# EAGLE design GaggiaBoard_V1 (EAGLE 9.6.2)

## Sheet 1 of 2
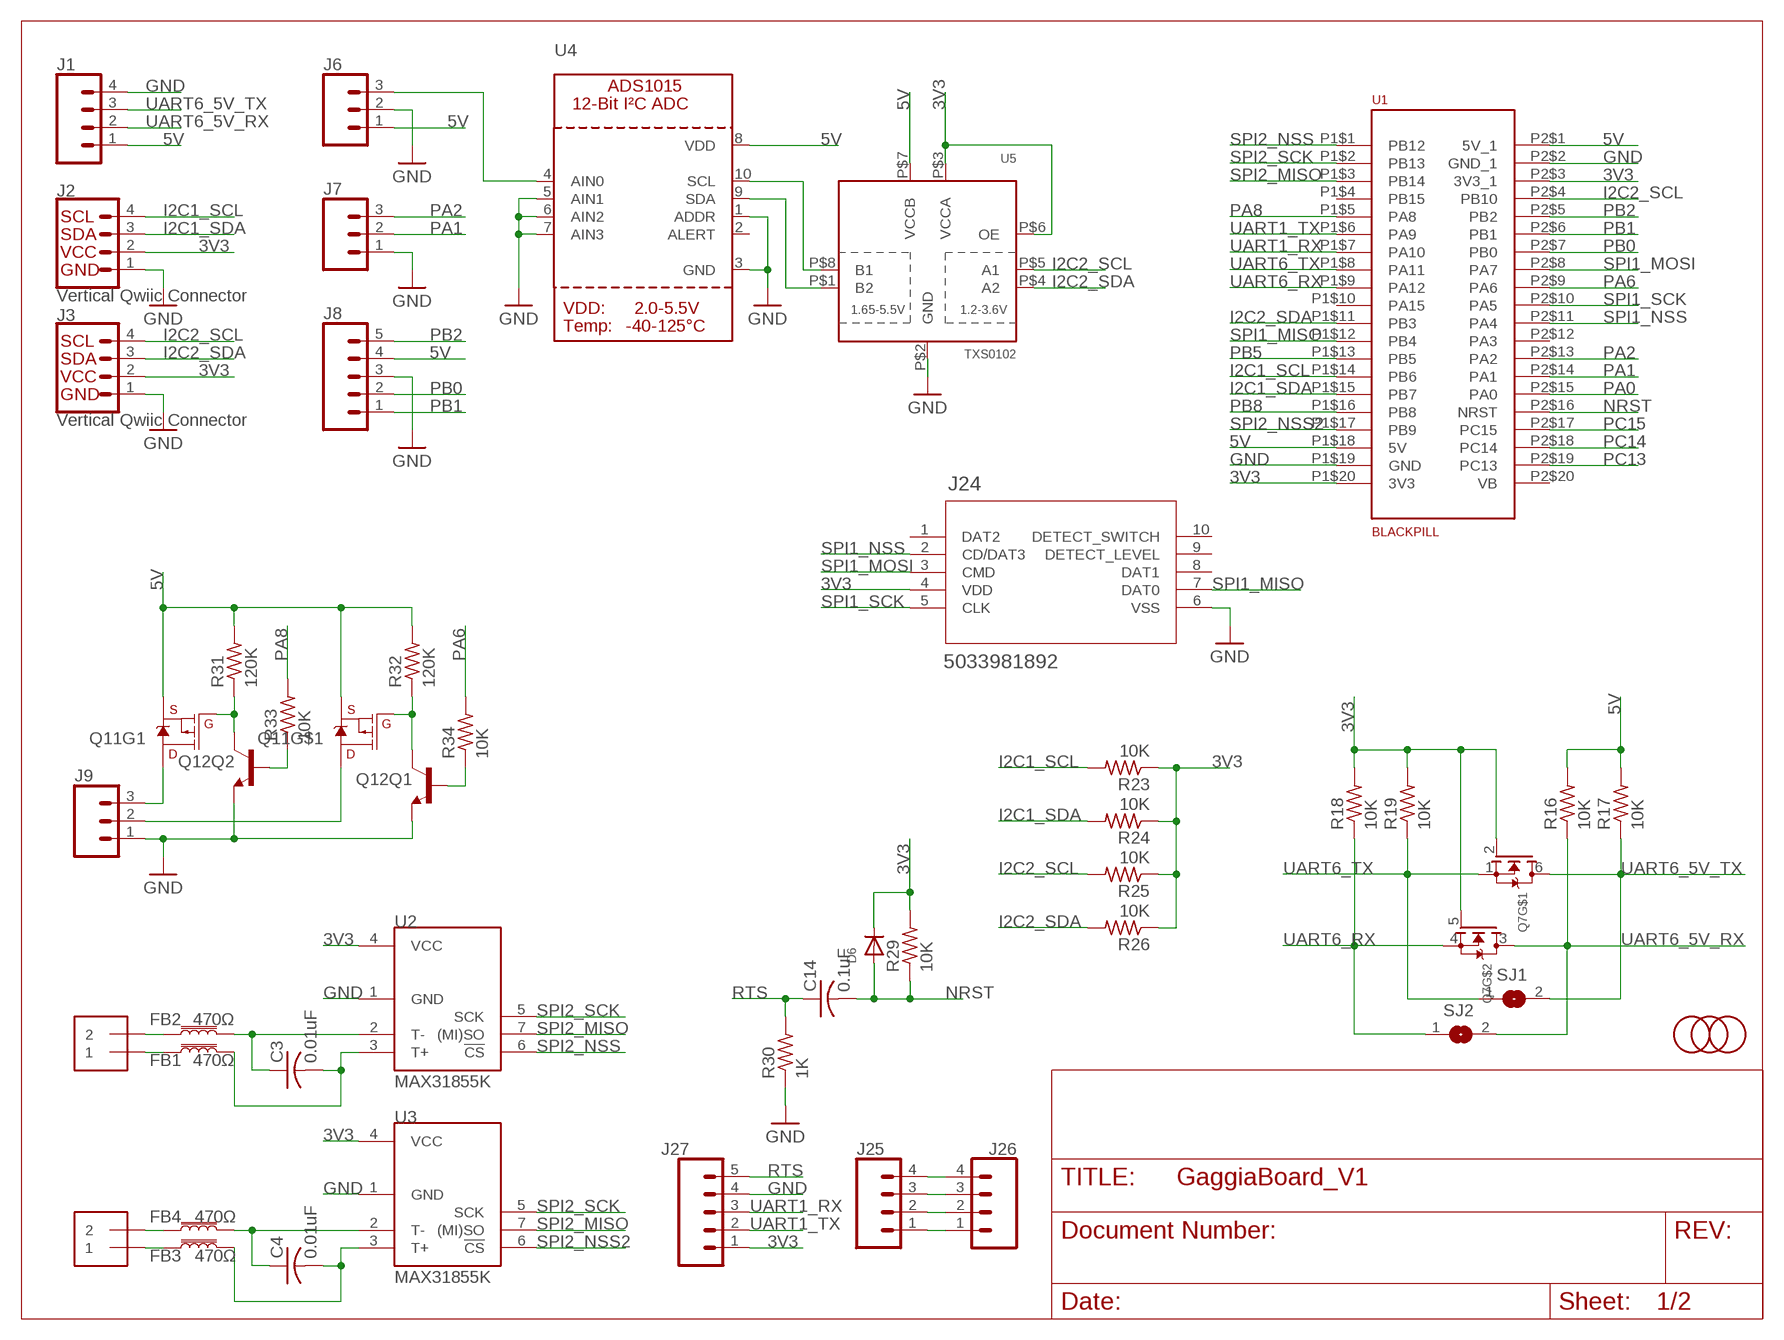
[diagram p0: schematic, sheet 1]

### Parts
C3  0.01uF  C-USC0603  [C0603]
C4  0.01uF  C-USC0603  [C0603]
C14  0.1uF  C-USC0603  [C0603]
D6  DIODESOD-123  [SOD-123]
FB1  470Ω  FERRITE_BEAD-0603-470Ω-100MHZ-1A-200MILIΩ  [0603]
FB2  470Ω  FERRITE_BEAD-0603-470Ω-100MHZ-1A-200MILIΩ  [0603]
FB3  470Ω  FERRITE_BEAD-0603-470Ω-100MHZ-1A-200MILIΩ  [0603]
FB4  470Ω  FERRITE_BEAD-0603-470Ω-100MHZ-1A-200MILIΩ  [0603]
J1  CONN_04POLAR  [MOLEX-1X4]
J2  Vertical Qwiic Connector  QWIIC_CONNECTOR  [JST04_1MM_VERT]
J3  Vertical Qwiic Connector  QWIIC_CONNECTOR  [JST04_1MM_VERT]
J4  1X2-3.5MM  [1X2-3.5MM]
J5  1X2-3.5MM  [1X2-3.5MM]
J6  CONN_03JST-PTH-VERT  [JST-3-PTH-VERT]
J7  CONN_03JST-PTH-VERT  [JST-3-PTH-VERT]
J8  CONN_05JST-VERT  [JST-5-PTH-VERT]
J9  CONN_03JST-PTH-VERT  [JST-3-PTH-VERT]
J24  5033981892  [503398-1892_MOL]
J25  CONN_041X04_NO_SILK  [1X04_NO_SILK]
J26  CONN_041X04_NO_SILK  [1X04_NO_SILK]
J27  CONN_05NO_SILK  [1X05_NO_SILK]
MARK1  FIDUCIAL  [FIDUCIAL_1MM]
MARK2  FIDUCIAL  [FIDUCIAL_1MM]
MARK5  FIDUCIAL  [FIDUCIAL_1MM]
Q7  MOSFET-N_DUAL  [SOT363]
Q11  MOSFET_PCH_DUAL-DMP2240UDM  [SOT26]
Q12  TRANS_NPN_DUAL-MBT3904DW1T1  [SC70-6]
R16  10K  R-US_R0603  [R0603]
R17  10K  R-US_R0603  [R0603]
R18  10K  R-US_R0603  [R0603]
R19  10K  R-US_R0603  [R0603]
R23  10K  R-US_R0603  [R0603]
R24  10K  R-US_R0603  [R0603]
R25  10K  R-US_R0603  [R0603]
R26  10K  R-US_R0603  [R0603]
R29  10K  R-US_R0603  [R0603]
R30  1K  R-US_R0603  [R0603]
R31  120K  R-US_R0603  [R0603]
R32  120K  R-US_R0603  [R0603]
R33  10K  R-US_R0603  [R0603]
R34  10K  R-US_R0603  [R0603]
SJ1  SOLDERJUMPER  [SOLDERJUMPER_ARROW_NOPASTE]
SJ2  SOLDERJUMPER  [SOLDERJUMPER_ARROW_NOPASTE]
U1  BLACKPILL  [BLACKPILL]
U2  MAX31855K  [SO08]
U3  MAX31855K  [SO08]
U4  ADC_ADS1015  [MSOP10]
U5  TXS0102  [VFSOP-8]

### Nets
3V3: D6.C J2.2 J3.2 J24.4(VDD) J25.1 J26.1 J27.1 Q7.2(G) Q7.5(G) R18.2 R19.2 R23.1 R24.1 R25.1 R26.1 R29.2 U1.P1$20(3V3) U1.P2$3(3V3_1) U2.4(VCC) U3.4(VCC) U5.P$3(VCCA) U5.P$6(OE) ; also sheet 2
5V: J1.1 J6.1 J8.4 Q11.S1(S) Q11.S2(S) R16.2 R17.2 R31.2 R32.2 U1.P1$18(5V) U1.P2$1(5V_1) U4.8(VDD) U5.P$7(VCCB) ; also sheet 2
GND: J1.4 J2.1 J3.1 J6.2 J7.1 J8.3 J9.1 J24.6(VSS) J25.4 J26.4 J27.4 Q12.1(Q2:E) Q12.4(Q1:E) R30.1 U1.P1$19(GND) U1.P2$2(GND_1) U2.1(GND) U3.1(GND) U4.1(ADDR) U4.3(GND) U4.5(AIN1) U4.6(AIN2) U4.7(AIN3) U5.P$2(GND) ; also sheet 2
I2C1_SCL: J2.4 R23.2 U1.P1$14(PB6)
I2C1_SDA: J2.3 R24.2 U1.P1$15(PB7)
I2C2_SCL: J3.4 R25.2 U1.P2$4(PB10) U5.P$5(A1)
I2C2_SDA: J3.3 R26.2 U1.P1$11(PB3) U5.P$4(A2)
N$3: FB2.1 J4.2
N$4: FB1.1 J4.1
N$5: C3.1 FB2.2 U2.2(T-)
N$6: FB4.1 J5.2
N$22: U4.10(SCL) U5.P$8(B1)
N$23: FB3.1 J5.1
N$25: C4.1 FB4.2 U3.2(T-)
N$26: C3.2 FB1.2 U2.3(T+)
N$31: C4.2 FB3.2 U3.3(T+)
N$38: U4.9(SDA) U5.P$1(B2)
N$41: J9.2 Q11.D2(D)
N$42: J9.3 Q11.D1(D)
N$46: Q12.2(Q2:B) R33.1
N$47: Q11.G2(G) Q12.3(Q1:C) R32.1
N$48: Q11.G1(G) Q12.6(Q2:C) R31.1
N$49: Q12.5(Q1:B) R34.1
NRST: C14.2 D6.A R29.1 U1.P2$16(NRST)
PA0: U1.P2$15(PA0) ; also sheet 2
PA1: J7.2 U1.P2$14(PA1)
PA2: J7.3 U1.P2$13(PA2)
PA6: R34.2 U1.P2$9(PA6)
PA8: R33.2 U1.P1$5(PA8)
PB0: J8.2 U1.P2$7(PB0)
PB1: J8.1 U1.P2$6(PB1)
PB2: J8.5 U1.P2$5(PB2)
PB5: U1.P1$13(PB5) ; also sheet 2
PB8: U1.P1$16(PB8) ; also sheet 2
PC13: U1.P2$19(PC13) ; also sheet 2
PC14: U1.P2$18(PC14) ; also sheet 2
PC15: U1.P2$17(PC15) ; also sheet 2
PRESSURE: J6.3 U4.4(AIN0)
RTS: C14.1 J27.5 R30.2
SPI1_MISO: J24.7(DAT0) U1.P1$12(PB4)
SPI1_MOSI: J24.3(CMD) U1.P2$8(PA7)
SPI1_NSS: J24.2(CD/DAT3) U1.P2$11(PA4)
SPI1_SCK: J24.5(CLK) U1.P2$10(PA5)
SPI2_MISO: U1.P1$3(PB14) U2.7((MI)SO) U3.7((MI)SO)
SPI2_NSS: U1.P1$1(PB12) U2.6(!CS)
SPI2_NSS2: U1.P1$17(PB9) U3.6(!CS)
SPI2_SCK: U1.P1$2(PB13) U2.5(SCK) U3.5(SCK)
SWCLK: J25.3 J26.3
SWDIO: J25.2 J26.2
UART1_RX: J27.3 U1.P1$7(PA10)
UART1_TX: J27.2 U1.P1$6(PA9)
UART6_5V_RX: J1.2 Q7.3(D) R16.1 SJ2.2
UART6_5V_TX: J1.3 Q7.6(D) R17.1 SJ1.2
UART6_RX: Q7.4(S) R18.1 SJ2.1 U1.P1$9(PA12)
UART6_TX: Q7.1(S) R19.1 SJ1.1 U1.P1$8(PA11)
Unconnected: J24.1(DAT2) J24.8(DAT1) J24.9(DETECT_LEVEL) J24.10(DETECT_SWITCH) U1.P1$4(PB15) U1.P1$10(PA15) U1.P2$12(PA3) U1.P2$20(VB) U4.2(ALERT)

## Sheet 2 of 2
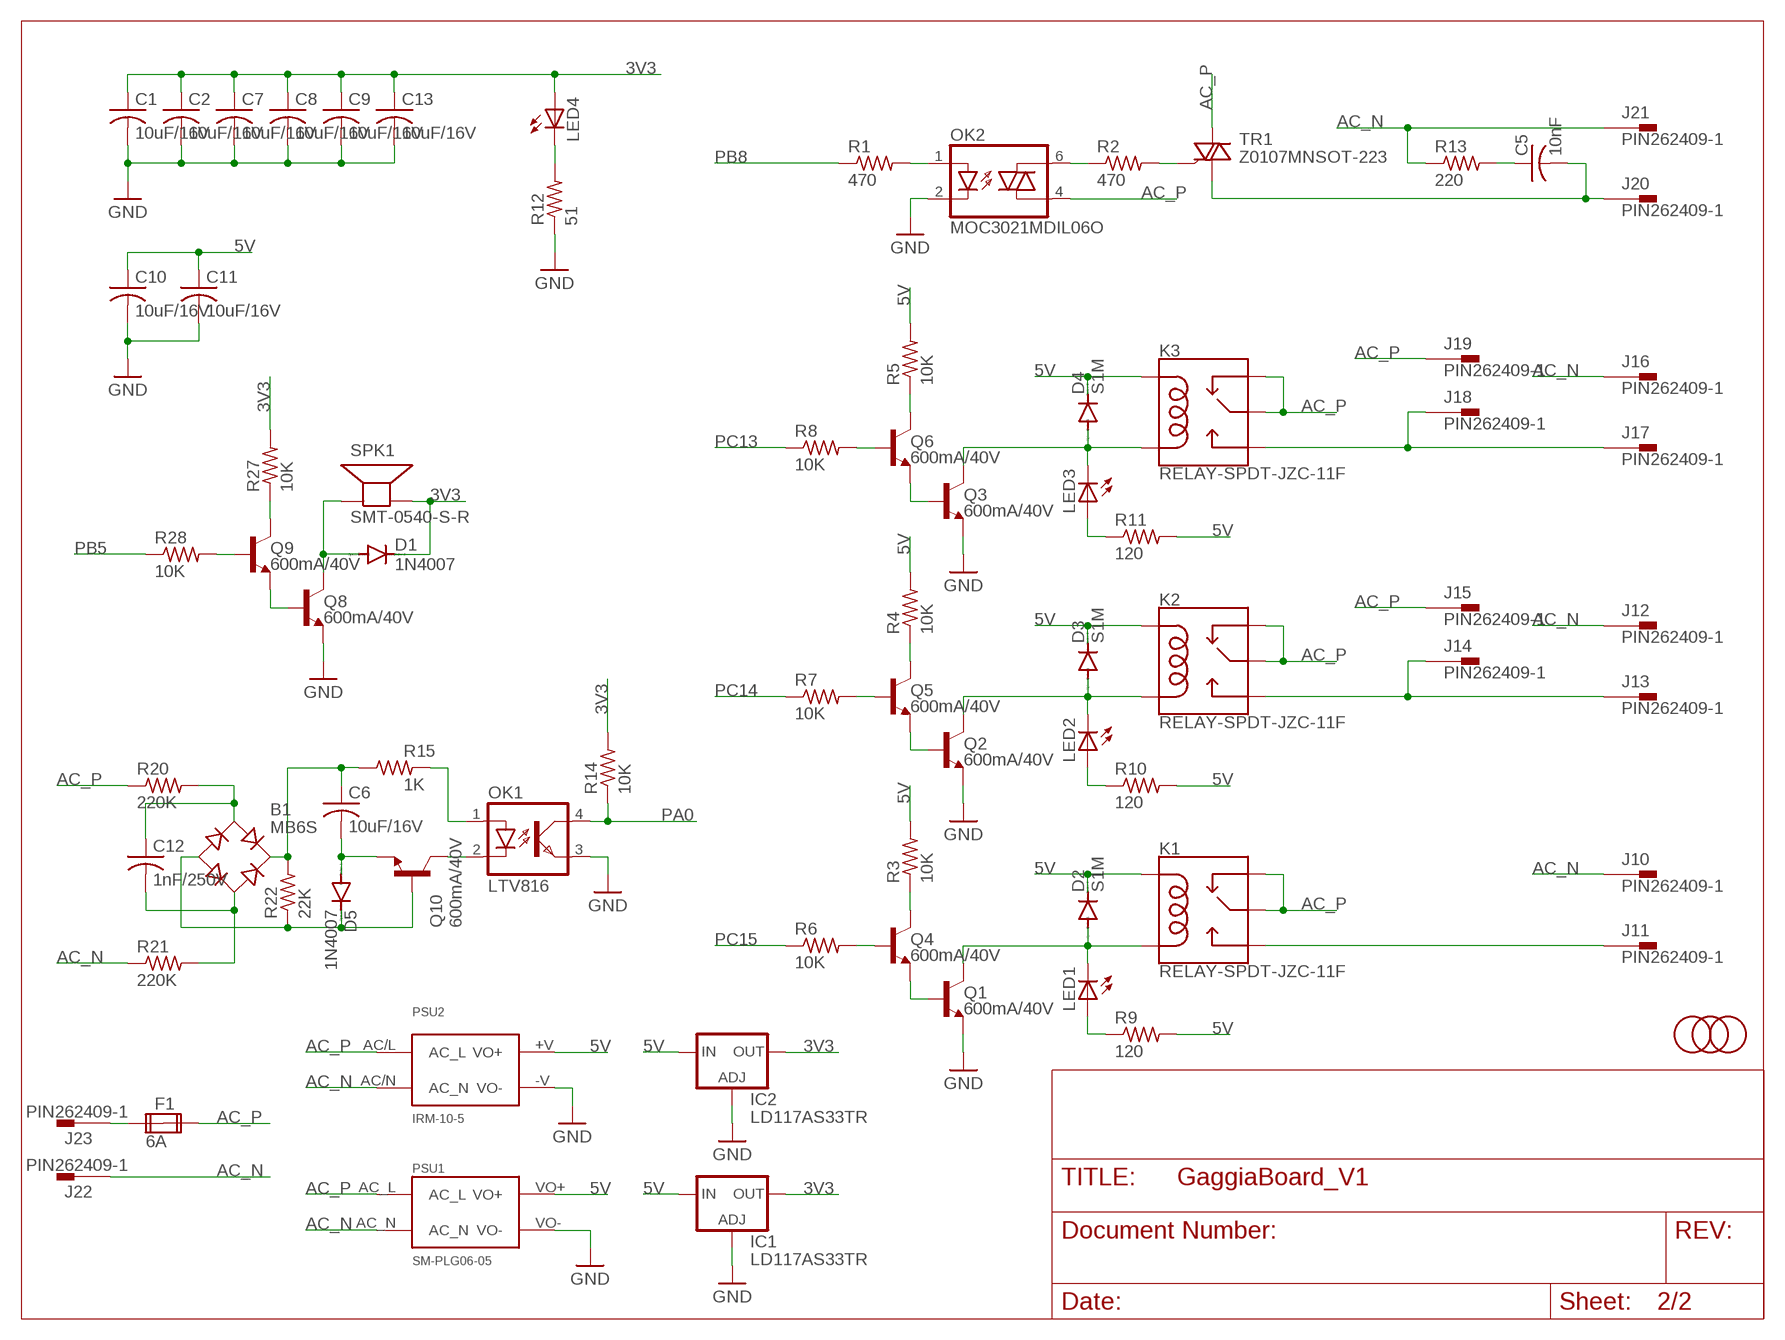
[diagram p1: schematic, sheet 2]

### Parts
B1  MB6S  [SOIC-4]
C1  10uF/16V  C-USC0603  [C0603]
C2  10uF/16V  C-USC0603  [C0603]
C5  10nF  C-USC1206  [C1206]
C6  10uF/16V  C-USC0603  [C0603]
C7  10uF/16V  C-USC0603  [C0603]
C8  10uF/16V  C-USC0603  [C0603]
C9  10uF/16V  C-USC0603  [C0603]
C10  10uF/16V  C-USC0603  [C0603]
C11  10uF/16V  C-USC0603  [C0603]
C12  1nF/250V  C-USC0603  [C0603]
C13  10uF/16V  C-USC0603  [C0603]
D1  1N4007  DIODE-DO214AC  [DO214AC]
D2  S1M  [SMA]
D3  S1M  [SMA]
D4  S1M  [SMA]
D5  1N4007  DIODE-DO214AC  [DO214AC]
F1  6A  FUSE2P  [FUSE1]
IC1  LD117AS33TR  [SOT223]
IC2  LD117AS33TR  [SOT223]
J10  PIN262409-1  [62409-1]
J11  PIN262409-1  [62409-1]
J12  PIN262409-1  [62409-1]
J13  PIN262409-1  [62409-1]
J14  PIN262409-1  [62409-1]
J15  PIN262409-1  [62409-1]
J16  PIN262409-1  [62409-1]
J17  PIN262409-1  [62409-1]
J18  PIN262409-1  [62409-1]
J19  PIN262409-1  [62409-1]
J20  PIN262409-1  [62409-1]
J21  PIN262409-1  [62409-1]
J22  PIN262409-1  [62409-1]
J23  PIN262409-1  [62409-1]
K1  RELAY-SPDT-JZC-11F  [RELAY-JZC]
K2  RELAY-SPDT-JZC-11F  [RELAY-JZC]
K3  RELAY-SPDT-JZC-11F  [RELAY-JZC]
LED1  LEDCHIPLED_1206  [CHIPLED_1206]
LED2  LEDCHIPLED_1206  [CHIPLED_1206]
LED3  LEDCHIPLED_1206  [CHIPLED_1206]
LED4  LEDCHIPLED_1206  [CHIPLED_1206]
MARK3  FIDUCIAL  [FIDUCIAL_1MM]
MARK4  FIDUCIAL  [FIDUCIAL_1MM]
MARK6  FIDUCIAL  [FIDUCIAL_1MM]
OK1  LTV816  [DIL04]
OK2  MOC3021MDIL06O  [DIL06O]
PSU1  SM-PLG06-05  [SM-PLG06]
PSU2  IRM-10-5  [IRM-10]
Q1  600mA/40V  TRANS_NPN-MMBT2222AL  [SOT23-3]
Q2  600mA/40V  TRANS_NPN-MMBT2222AL  [SOT23-3]
Q3  600mA/40V  TRANS_NPN-MMBT2222AL  [SOT23-3]
Q4  600mA/40V  TRANS_NPN-MMBT2222AL  [SOT23-3]
Q5  600mA/40V  TRANS_NPN-MMBT2222AL  [SOT23-3]
Q6  600mA/40V  TRANS_NPN-MMBT2222AL  [SOT23-3]
Q8  600mA/40V  TRANS_NPN-MMBT2222AL  [SOT23-3]
Q9  600mA/40V  TRANS_NPN-MMBT2222AL  [SOT23-3]
Q10  600mA/40V  TRANS_NPN-MMBT2222AL  [SOT23-3]
R1  470  R-US_R0603  [R0603]
R2  470  R-US_R0603  [R0603]
R3  10K  R-US_R0603  [R0603]
R4  10K  R-US_R0603  [R0603]
R5  10K  R-US_R0603  [R0603]
R6  10K  R-US_R0603  [R0603]
R7  10K  R-US_R0603  [R0603]
R8  10K  R-US_R0603  [R0603]
R9  120  R-US_R0603  [R0603]
R10  120  R-US_R0603  [R0603]
R11  120  R-US_R0603  [R0603]
R12  51  R-US_R0603  [R0603]
R13  220  R-US_R2512  [R2512]
R14  10K  R-US_R0603  [R0603]
R15  1K  R-US_R0603  [R0603]
R20  220K  R-US_R1206  [R1206]
R21  220K  R-US_R1206  [R1206]
R22  22K  R-US_R0603  [R0603]
R27  10K  R-US_R0603  [R0603]
R28  10K  R-US_R0603  [R0603]
SPK1  SMT-0540-S-R  [SMT-0540-S-R]
TR1  Z0107MNSOT-223  [SOT223]

### Nets
3V3: C1.1 C2.1 C7.1 C8.1 C9.1 C13.1 D1.C IC1.4(OUT) IC2.4(OUT) LED4.A R14.2 R27.2 SPK1.+(-) ; also sheet 1
3WAY: J11.A1 J11.A2 K1.3(NO)
5V: C10.1 C11.1 D2.C D3.C D4.C IC1.3(IN) IC2.3(IN) K1.5(COIL1) K2.5(COIL1) K3.5(COIL1) PSU1.VO+ PSU2.+V(VO+) R3.2 R4.2 R5.2 R9.2 R10.2 R11.2 ; also sheet 1
AC_N: J10.A1 J10.A2 J12.A1 J12.A2 J16.A1 J16.A2 J21.A1 J21.A2 J22.A1 J22.A2 PSU1.AC_N PSU2.AC/N(AC_N) R13.1 R21.1
AC_P: F1.2A J15.A1 J15.A2 J19.A1 J19.A2 K1.2(NC) K1.4(MAIN) K2.2(NC) K2.4(MAIN) K3.2(NC) K3.4(MAIN) OK2.4(A1) PSU1.AC_L PSU2.AC/L(AC_L) R20.1 TR1.2(A2) TR1.4(A2)
GND: C1.2 C2.2 C7.2 C8.2 C9.2 C10.2 C11.2 C13.2 IC1.1(ADJ) IC2.1(ADJ) OK1.3(EMIT) OK2.2(C) PSU1.VO- PSU2.-V(VO-) Q1.2(E) Q2.2(E) Q3.2(E) Q8.2(E) R12.1 ; also sheet 1
HEATER_1: J13.A1 J13.A2 J14.A1 J14.A2 K2.3(NO)
HEATER_2: J17.A1 J17.A2 J18.A1 J18.A2 K3.3(NO)
N$1: F1.1A J23.A1 J23.A2
N$2: B1.- D5.C Q10.1(B) R22.1
N$7: OK1.2(C) Q10.3(C)
N$8: OK2.6(A2) R2.1
N$9: R2.2 TR1.3(G)
N$10: D2.A K1.1(COIL2) LED1.C Q1.3(C)
N$11: D3.A K2.1(COIL2) LED2.C Q2.3(C)
N$12: D4.A K3.1(COIL2) LED3.C Q3.3(C)
N$13: Q1.1(B) Q4.2(E)
N$14: Q2.1(B) Q5.2(E)
N$15: Q3.1(B) Q6.2(E)
N$16: Q6.1(B) R8.2
N$17: Q6.3(C) R5.1
N$18: Q5.3(C) R4.1
N$19: Q5.1(B) R7.2
N$20: Q4.3(C) R3.1
N$21: Q4.1(B) R6.2
N$24: LED1.A R9.1
N$27: LED4.C R12.2
N$28: LED2.A R10.1
N$29: LED3.A R11.1
N$30: D1.A Q8.3(C) SPK1.-(+)
N$32: C5.1 R13.2
N$33: Q8.1(B) Q9.2(E)
N$34: Q9.1(B) R28.2
N$35: Q9.3(C) R27.1
N$36: B1.~1(AC1) C12.2 R21.2
N$37: B1.~2(AC2) C12.1 R20.2
N$39: OK2.1(A) R1.2
N$43: C6.2 D5.A Q10.2(E)
N$44: OK1.1(A) R15.2
N$45: B1.+ C6.1 R15.1 R22.2
PA0: OK1.4(COL) R14.1 ; also sheet 1
PB5: R28.1 ; also sheet 1
PB8: R1.1 ; also sheet 1
PC13: R8.1 ; also sheet 1
PC14: R7.1 ; also sheet 1
PC15: R6.1 ; also sheet 1
PUMP_P: C5.2 J20.A1 J20.A2 TR1.1(A1)
Unconnected: F1.1B F1.2B

## Library data of the parts
B1 = rectifier:MB*S: Bridge Rectifier Source: http://www.fairchildsemi.com/ds/MB/MB6S.pdf; LCSC: C2487
C1 C2 C6-C11 C13 = rcl:C-US: CAPACITOR, American symbol; LCSC: C86275; SPICEPREFIX: C
C3 C4 = rcl:C-US: CAPACITOR, American symbol; LCSC: C100042; SPICEPREFIX: C
C5 = rcl:C-US: CAPACITOR, American symbol; LCSC: C107192; SPICEPREFIX: C
C12 = rcl:C-US: CAPACITOR, American symbol; LCSC: C277510; SPICEPREFIX: C
C14 = rcl:C-US: CAPACITOR, American symbol; LCSC: C14663; SPICEPREFIX: C
D1 D5 = diode:DIODE-: DIODE; LCSC: C727081
D2-D4 = diode:S1M; LCSC: C155378
D6 = adafruit:DIODE: Diode SMADIODE - SMA Surface Mount Package 20V 1A Schottky Diode Digikey: 641-1014-6-ND DO-1N4148 - Through Hole Small Current Diode SOD-123 20V 1 A (.5mV Vf) Schottky Diode - Digikey: MBRX120TPMSCT-ND SOD-323 10V 570mA (.38mV Vf, 3ns) Schottky Diode - Digikey: ZLLS410CT-ND SOD-523 30V 30mA Schottky Diode (RB751S-40TE61) - Digikey: RB751S-40TE61CT-ND SOT23-R/W - SOT23 Package (R = Solder Paste/Reflow Ovens, W = Hand-Soldering) BAT54Film 40V 300mA - Digikey: 497-7162-1-ND; LCSC: C83528
F1 = special:FUSE2P: FUSE 5 x 20 mm; LCSC: C206887
FB1-FB4 = SparkFun-Coils:FERRITE_BEAD: Ferrite Bead (blocks, cores, rings, chokes, etc.) Inductor with layers of ferrite used to suppress high frequencies. Often used to isolate high frequency noise. SparkFun Products: IOIO-OTG - V2.2 <https://www.sparkfun.com/products/13613> SparkFun SAMD21 Mini Breakout <https://www.sparkfun.com/products/13664> SparkFun 6 Degrees of Freedom Breakout - LSM6DS3 <https://www.sparkfun.com/products/13339> SparkFun SAMD21 Dev Breakout <https://www.sparkfun.com/products/13672>; LCSC: C883591; PROD_ID: NDUC-12579
IC1 IC2 = v-reg:LD117A?*: Low drop fixed and adjustable positive voltage regulators 1 A Source: http://www.st.com/stonline/products/literature/ds/7194/ld1117axx.pdf; LCSC: C152529
J1 = SparkFun-Connectors:CONN_04: Multi connection point. Often used as Generic Header-pin footprint for 0.1 inch spaced/style header connections On any of the 0.1 inch spaced packages, you can populate with these: Break Away Headers - Straight <https://www.sparkfun.com/products/116> (PRT-00116) Break Away Male Headers - Right Angle <https://www.sparkfun.com/products/553> (PRT-00553) Female Headers <https://www.sparkfun.com/products/115> (PRT-00115) Break Away Headers - Machine Pin <https://www.sparkfun.com/products/117> (PRT-00117) Break Away Female Headers - Swiss Machine Pin <https://www.sparkfun.com/products/743> (PRT-00743) For SCREWTERMINALS and SPRING TERMINALS visit here: Screw Terimnals on SparkFun.com <https://www.sparkfun.com/search/results?term=Screw+Terminals> (5mm/3.5mm/2.54mm spacing) This device is also useful as a general connection point to wire up your design to another part of your project. Our various solder wires solder well into these plated through hole pads. Hook-Up Wire - Assortment (Stranded, 22 AWG) <https://www.sparkfun.com/products/11375> (PRT-11375) Hook-Up Wire - Assortment (Solid Core, 22 AWG) <https://www.sparkfun.com/products/11367> (PRT-11367) View the entire wire category on our website here <https://www.sparkfun.com/categories/141> Special notes: Molex polarized connector foot print use with SKU : PRT-08231 with associated crimp pins and housings. 1MM SMD Version SKU: PRT-10208; LCSC: C144395; PROD_ID: CONN-08186; SF_ID: PRT-08231
J2 J3 = SparkFun-Connectors:QWIIC_CONNECTOR: SparkFun I2C Standard Qwiic Connector An SMD 1mm pitch JST connector makes it easy and quick (get it? Qwiic?) to connect I2C devices to each other. The Qwiic system <http://www.sparkfun.com/qwiic> enables fast and solderless connection between popular platforms and various sensors and actuators. We carry 200mm <https://www.sparkfun.com/products/14204>, 100mm <https://www.sparkfun.com/products/14205>, 50mm <https://www.sparkfun.com/products/14206>, and breadboard friendly <https://www.sparkfun.com/products/14207> Qwiic cables. We also offer 10 pcs strips <https://www.sparkfun.com/products/14323> the SMD connectors.; LCSC: C160390; PROD_ID: CONN-14483
J4 J5 = adafruit:1X2: 3.5mm Terminal block http://www.ladyada.net/library/pcb/eaglelibrary.html; LCSC: C474892
J6 J7 J9 = SparkFun-Connectors:CONN_03: Multi connection point. Often used as Generic Header-pin footprint for 0.1 inch spaced/style header connections On any of the 0.1 inch spaced packages, you can populate with these: Break Away Headers - Straight <https://www.sparkfun.com/products/116> (PRT-00116) Break Away Male Headers - Right Angle <https://www.sparkfun.com/products/553> (PRT-00553) Female Headers <https://www.sparkfun.com/products/115> (PRT-00115) Break Away Headers - Machine Pin <https://www.sparkfun.com/products/117> (PRT-00117) Break Away Female Headers - Swiss Machine Pin <https://www.sparkfun.com/products/743> (PRT-00743) Stackable Header - 3 Pin (Female, 0.1") <https://www.sparkfun.com/products/13875> (PRT-13875) For SCREWTERMINALS and SPRING TERMINALS visit here: Screw Terimnals on SparkFun.com <https://www.sparkfun.com/search/results?term=Screw+Terminals> (5mm/3.5mm/2.54mm spacing) This device is also useful as a general connection point to wire up your design to another part of your project. Our various solder wires solder well into these plated through hole pads. Hook-Up Wire - Assortment (Stranded, 22 AWG) <https://www.sparkfun.com/products/11375> (PRT-11375) Hook-Up Wire - Assortment (Solid Core, 22 AWG) <https://www.sparkfun.com/products/11367> (PRT-11367) View the entire wire category on our website here <https://www.sparkfun.com/categories/141> Special notes: Molex polarized connector foot print use with SKU : PRT-08232 with associated crimp pins and housings.; LCSC: C131339; PROD_ID: CONN-13230
J8 = SparkFun-Connectors:CONN_05: Multi connection point. Often used as Generic Header-pin footprint for 0.1 inch spaced/style header connections On any of the 0.1 inch spaced packages, you can populate with these: Break Away Headers - Straight <https://www.sparkfun.com/products/116> (PRT-00116) Break Away Male Headers - Right Angle <https://www.sparkfun.com/products/553> (PRT-00553) Female Headers <https://www.sparkfun.com/products/115> (PRT-00115) Break Away Headers - Machine Pin <https://www.sparkfun.com/products/117> (PRT-00117) Break Away Female Headers - Swiss Machine Pin <https://www.sparkfun.com/products/743> (PRT-00743) For SCREWTERMINALS and SPRING TERMINALS visit here: Screw Terimnals on SparkFun.com <https://www.sparkfun.com/search/results?term=Screw+Terminals> (5mm/3.5mm/2.54mm spacing) This device is also useful as a general connection point to wire up your design to another part of your project. Our various solder wires solder well into these plated through hole pads. Hook-Up Wire - Assortment (Stranded, 22 AWG) <https://www.sparkfun.com/products/11375> (PRT-11375) Hook-Up Wire - Assortment (Solid Core, 22 AWG) <https://www.sparkfun.com/products/11367> (PRT-11367) View the entire wire category on our website here <https://www.sparkfun.com/categories/141> Special notes: Molex polarized connector foot print use with SKU : PRT-08231 with associated crimp pins and housings. 1MM SMD Version SKU: PRT-10208; LCSC: C157993
J10-J23 = con-faston:PIN2: Flachstecker Typ Tyco/Electronics/AMP TAB, FASTON Printed Circuit Board Tabs Source: http://www.buerklin.com, http://catalog.tycoelectronics.com; LCSC: C86495; OC_FARNELL: unknown; OC_NEWARK: unknown
J24 = discrete:5033981892: MOLEX 503398-1892 MEMORY CARD SOCKET; COPYRIGHT: Copyright (C) 2022 Ultra Librarian. All rights reserved.; LCSC: C428492; MANUFACTURER_PART_NUMBER: 5033981892; MFR_NAME: Molex Connector Corporation
J25 J26 = SparkFun-Connectors:CONN_04: Multi connection point. Often used as Generic Header-pin footprint for 0.1 inch spaced/style header connections On any of the 0.1 inch spaced packages, you can populate with these: Break Away Headers - Straight <https://www.sparkfun.com/products/116> (PRT-00116) Break Away Male Headers - Right Angle <https://www.sparkfun.com/products/553> (PRT-00553) Female Headers <https://www.sparkfun.com/products/115> (PRT-00115) Break Away Headers - Machine Pin <https://www.sparkfun.com/products/117> (PRT-00117) Break Away Female Headers - Swiss Machine Pin <https://www.sparkfun.com/products/743> (PRT-00743) For SCREWTERMINALS and SPRING TERMINALS visit here: Screw Terimnals on SparkFun.com <https://www.sparkfun.com/search/results?term=Screw+Terminals> (5mm/3.5mm/2.54mm spacing) This device is also useful as a general connection point to wire up your design to another part of your project. Our various solder wires solder well into these plated through hole pads. Hook-Up Wire - Assortment (Stranded, 22 AWG) <https://www.sparkfun.com/products/11375> (PRT-11375) Hook-Up Wire - Assortment (Solid Core, 22 AWG) <https://www.sparkfun.com/products/11367> (PRT-11367) View the entire wire category on our website here <https://www.sparkfun.com/categories/141> Special notes: Molex polarized connector foot print use with SKU : PRT-08231 with associated crimp pins and housings. 1MM SMD Version SKU: PRT-10208; PROD_ID: CONN-09696
J27 = SparkFun-Connectors:CONN_05: Multi connection point. Often used as Generic Header-pin footprint for 0.1 inch spaced/style header connections On any of the 0.1 inch spaced packages, you can populate with these: Break Away Headers - Straight <https://www.sparkfun.com/products/116> (PRT-00116) Break Away Male Headers - Right Angle <https://www.sparkfun.com/products/553> (PRT-00553) Female Headers <https://www.sparkfun.com/products/115> (PRT-00115) Break Away Headers - Machine Pin <https://www.sparkfun.com/products/117> (PRT-00117) Break Away Female Headers - Swiss Machine Pin <https://www.sparkfun.com/products/743> (PRT-00743) For SCREWTERMINALS and SPRING TERMINALS visit here: Screw Terimnals on SparkFun.com <https://www.sparkfun.com/search/results?term=Screw+Terminals> (5mm/3.5mm/2.54mm spacing) This device is also useful as a general connection point to wire up your design to another part of your project. Our various solder wires solder well into these plated through hole pads. Hook-Up Wire - Assortment (Stranded, 22 AWG) <https://www.sparkfun.com/products/11375> (PRT-11375) Hook-Up Wire - Assortment (Solid Core, 22 AWG) <https://www.sparkfun.com/products/11367> (PRT-11367) View the entire wire category on our website here <https://www.sparkfun.com/categories/141> Special notes: Molex polarized connector foot print use with SKU : PRT-08231 with associated crimp pins and housings. 1MM SMD Version SKU: PRT-10208
K1-K3 = SparkFun-Electromechanical:RELAY-SPDT: SPDT Electromechanical Relay Single-pole, double-throw sealed relays. When current is applied to the coil, it throws a simple changeover switch, terminating the connection from the NC contact to ground and closing the NO contact. Use them to switch high voltage/high current devices. SparkFun Products JQX-15F: Relay SPDT Sealed - 20A <https://www.sparkfun.com/products/10924> (COM-10924) JZC-11F: Relay SPDT Sealed <https://www.sparkfun.com/products/100> (COM-00100); LCSC: C74541; PROD_ID: COMP-09533; SF_SKU: COM-00100
LED1-LED4 = adafruit:LED: LED OSRAM: - CHIPLED LG R971, LG N971, LY N971, LG Q971, LY Q971, LO R971, LY R971 LH N974, LH R974 LS Q976, LO Q976, LY Q976 LO Q996 - Hyper CHIPLED LW Q18S LB Q993, LB Q99A, LB R99A - SideLED LS A670, LO A670, LY A670, LG A670, LP A670 LB A673, LV A673, LT A673, LW A673 LH A674 LY A675 LS A676, LA A676, LO A676, LY A676, LW A676 LS A679, LY A679, LG A679 - Hyper Micro SIDELED® LS Y876, LA Y876, LO Y876, LY Y876 LT Y87S - SmartLED LW L88C, LW L88S LB L89C, LB L89S, LG L890 LS L89K, LO L89K, LY L89K LS L896, LA L896, LO L896, LY L896 - TOPLED LS T670, LO T670, LY T670, LG T670, LP T670 LSG T670, LSP T670, LSY T670, LOP T670, LYG T670 LG T671, LOG T671, LSG T671 LB T673, LV T673, LT T673, LW T673 LH T674 LS T676, LA T676, LO T676, LY T676, LB T676, LH T676, LSB T676, LW T676 LB T67C, LV T67C, LT T67C, LS T67K, LO T67K, LY T67K, LW E67C LS E67B, LA E67B, LO E67B, LY E67B, LB E67C, LV E67C, LT E67C LW T67C LS T679, LY T679, LG T679 LS T770, LO T770, LY T770, LG T770, LP T770 LB T773, LV T773, LT T773, LW T773 LH T774 LS E675, LA E675, LY E675, LS T675 LS T776, LA T776, LO T776, LY T776, LB T776 LHGB T686 LT T68C, LB T68C - Hyper Mini TOPLED® LB M676 - Mini TOPLED Santana® LG M470 LS M47K, LO M47K, LY M47K Source: http://www.osram.convergy.de/; LCSC: C375534
MARK1-MARK6 = adafruit:FIDUCIAL: For use by pick and place machines to calibrate the vision/machine, 1mm By microbuilder.eu
OK1 = optocoupler:LTV816: OPTO COUPLER Source: LITEON, LTV816.pdf; LCSC: C2944043; OC_FARNELL: unknown; OC_NEWARK: unknown
OK2 = discrete:MOC3021M: RANDOM-PHASE OPTOISOLATORS TRIAC DRIVER OUTPUT; LCSC: C5242
PSU1 = discrete:SM-PLG06-05: AC-DC 5V Isolated Switching Power Supply Module
PSU2 = discrete:IRM-10-5: MEAN WELL IRM-10-5 5V 10W Output Switching Power Supply
Q1-Q6 Q8-Q10 = SparkFun-DiscreteSemi:TRANS_NPN: NPN transistor Current controlled devices typically used to amplify current or used as a switch. BC547 - COM-08928 <http://www.sparkfun.com/products/8928> (TO-92 45V 100mA) (1.Collector 2.Base 3.Emitter) 2N3904 - COM-00521 <http://www.sparkfun.com/products/521> (TO-92 40V 200mA) (1.Emitter 2.Base 3.Collector) P2N2222A - COM-12852 <http://www.sparkfun.com/products/12852> (TO-92 40V 600mA) (1.Collector 2.Base 3.Emitter); LCSC: C82460; PROD_ID: TRANS-08049
Q7 = microbuilder:MOSFET-N_DUAL: Dual N-Channel MOSFET SOT363 (2.0x1.25mm) 2N7002PS - 60V, 320mA [Digikey: 568-5984-1-ND]; LCSC: C150488
Q11 = SparkFun-DiscreteSemi:MOSFET_PCH_DUAL: Dual P-Channel -20VDS MOSFET Link to datasheet <http://www.diodes.com/_files/datasheets/ds31197.pdf> SparkFun Products: SparkFun FreeSoC2 Development Board <https://www.sparkfun.com/products/13229>; LCSC: C397948; PROD_ID: TRANS-12444; VALUE: 2A/20V/150mΩ
Q12 = SparkFun-DiscreteSemi:TRANS_NPN_DUAL: Dual NPN Transistors in Single Package The MBT3904W1 puts two general purpose 3904 NPN transistors in a single package. Datasheet <http://www.onsemi.com/pub_link/Collateral/MBT3904DW1T1-D.PDF> SparkFun Products: SparkFun ESP32 Thing <https://www.sparkfun.com/products/13907>; LCSC: C896759; PROD_ID: TRANS-13337
R1 R2 = rcl:R-US_: RESISTOR, American symbol; LCSC: C114669; SPICEPREFIX: R
R3-R8 R14 R16-R19 R23-R29 R33 R34 = rcl:R-US_: RESISTOR, American symbol; LCSC: C98220; SPICEPREFIX: R
R9-R11 = rcl:R-US_: RESISTOR, American symbol; LCSC: C114640; SPICEPREFIX: R
R12 = rcl:R-US_: RESISTOR, American symbol; LCSC: C114628; SPICEPREFIX: R
R13 = rcl:R-US_: RESISTOR, American symbol; LCSC: C877859; SPICEPREFIX: R
R15 R30 = rcl:R-US_: RESISTOR, American symbol; LCSC: C22548; SPICEPREFIX: R
R20 R21 = rcl:R-US_: RESISTOR, American symbol; LCSC: C130275; SPICEPREFIX: R
R22 = rcl:R-US_: RESISTOR, American symbol; LCSC: C114065; SPICEPREFIX: R
R31 R32 = rcl:R-US_: RESISTOR, American symbol; LCSC: C114607; SPICEPREFIX: R
SJ1 SJ2 = microbuilder:SOLDERJUMPER: SMD Solder JUMPER Solder the two pads together to create a connection, or remove the solder to break it. REFLOW - Use this footprint for solder paste and reflow ovens. WAVE - Use this footprint for hand-soldering (larger pads). CLOSED - Has a trace between the two pads to ensure it is closed by default. The trace needs to be cut to disable the jumper, and can be closed again by creating a solder bridge between the two pads.; BOM: EXCLUDE
SPK1 = adafruit:SMT-0540-S-R: SMT-0549-S-R Small surface-mount magnetic buzzer; LCSC: C391029
TR1 = discrete:Z0107MN: Triacs 1.0 Amp 600 Volt; LCSC: C71218
U1 = discrete:BLACKPILL: STM32 BlackPill
U2 U3 = SparkFun-IC-Conversion:MAX31855K: Cold-Junction-Compensated K-Thermocoupleto-Digital Converter (-270°C to +1800°C) The MAX31855K performs cold-junction compensation and digitizes the signal from a type-K thermocouple. The data is output in a 14-bit resolution, SPI™-compatible, read-only format. This converter resolves temperatures to 0.25°C, allows readings as high as +1800°C and as low as -270°C, and exhibits thermocouple accuracy of ±2°C for temperatures ranging from -200°C to +700°C for K-type thermocouples. Datasheet <https://cdn.sparkfun.com/datasheets/Sensors/Temp/MAX31855K.pdf> SparkFun Products SparkFun Thermocouple Breakout - MAX31855K <https://www.sparkfun.com/products/13266> (SEN-13266); LCSC: C52028; PROD_ID: IC-12578
U4 = microbuilder:ADC_ADS1015: ADS1015 - 12-bit 4-Channel I2C ADC with Internal PGA VDD: 2.0-5.5V Sampling Rate: 3.3ksps Gain Settings: 2/3, 1, 2, 4, 8, 16 I2C Address: ADDR low = 1001000x, ADDR high = 1001001x Internal Comparator The ADS1015 includes an internal comparator that can be set to output a high-level on ALERT when the conversion results exceeeds a pre-defined upper level, and will deassert itself when the level falls below a pre-defined lower threshold level. It can also be set to windowed mode where the ALERT pin will be asserted if the data exceeds the upper threshold or falls below the lower threshold.; LCSC: C193969
U5 = adafruit:TXS0102: 2-Bit Bi-Directional Level Shifter (I2C, etc.) Designed for I2C devices and has internal pullups. Not to be confused with TXB010x series. 1.2V-3.6V (VCCA) to 1.65V-5.5V (VCCB) bi-directional level shifter with auto direction sensing. Max data rate - 24Mbps (Push Pull), 2Mbps (Open Drain) Digikey: 296-21931-1-ND; LCSC: C53434

## Board
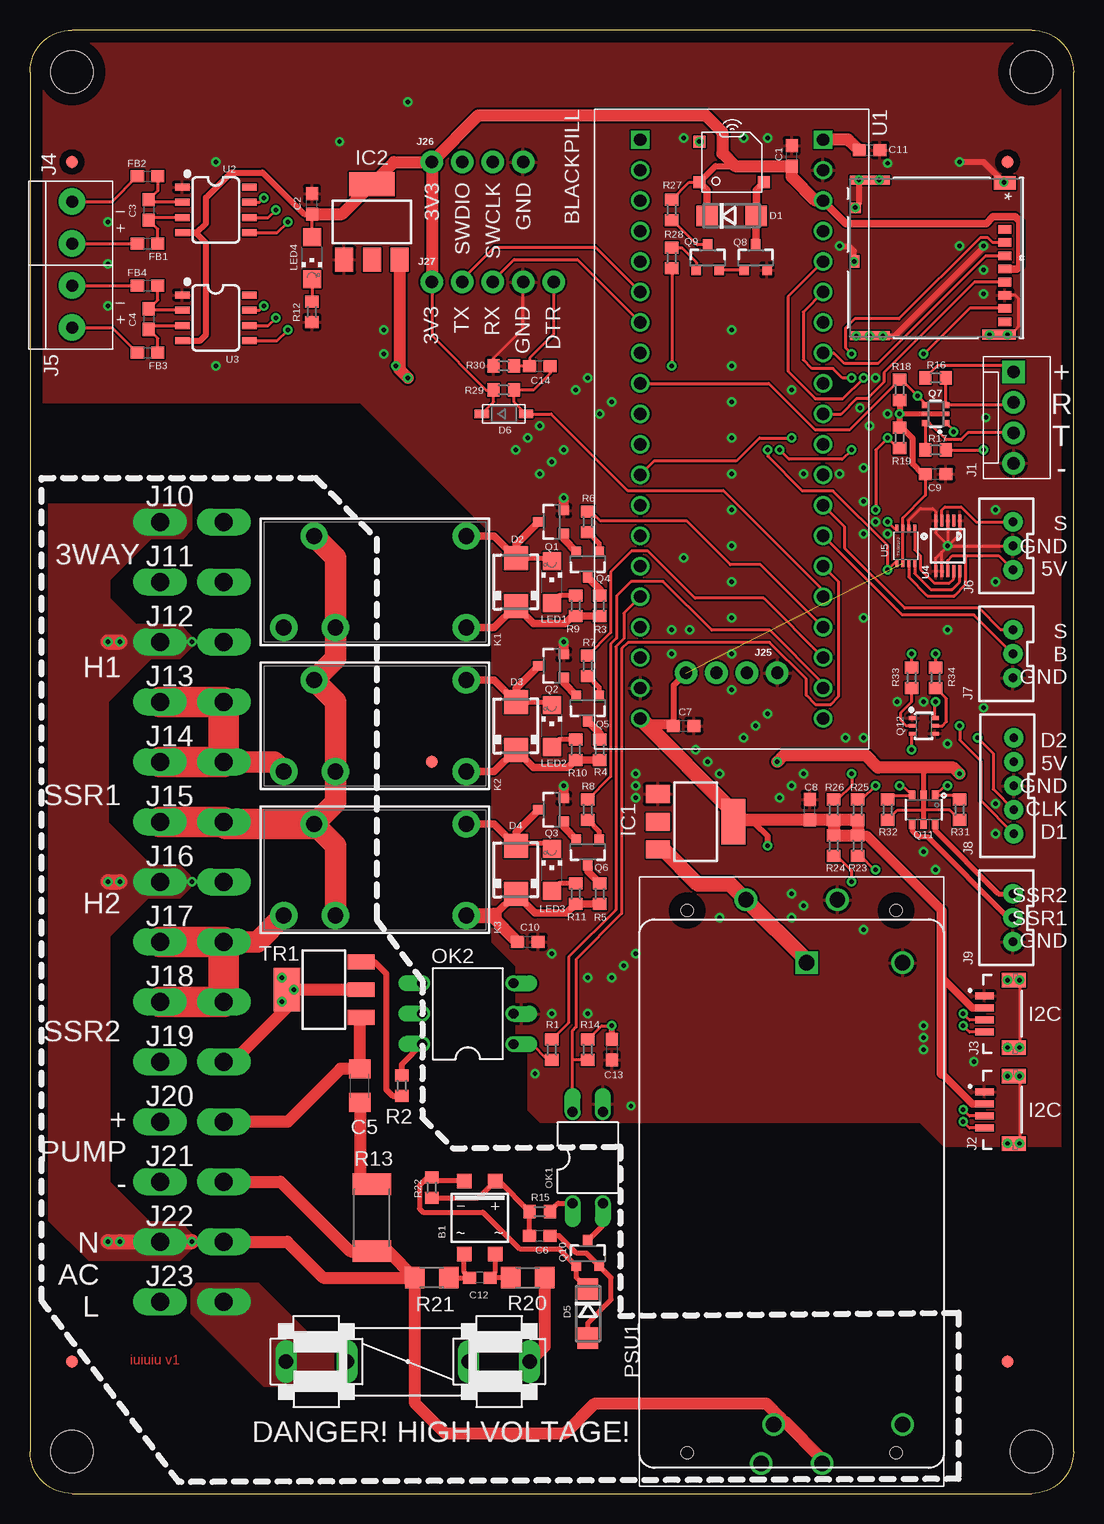
[diagram p2: board, top side]
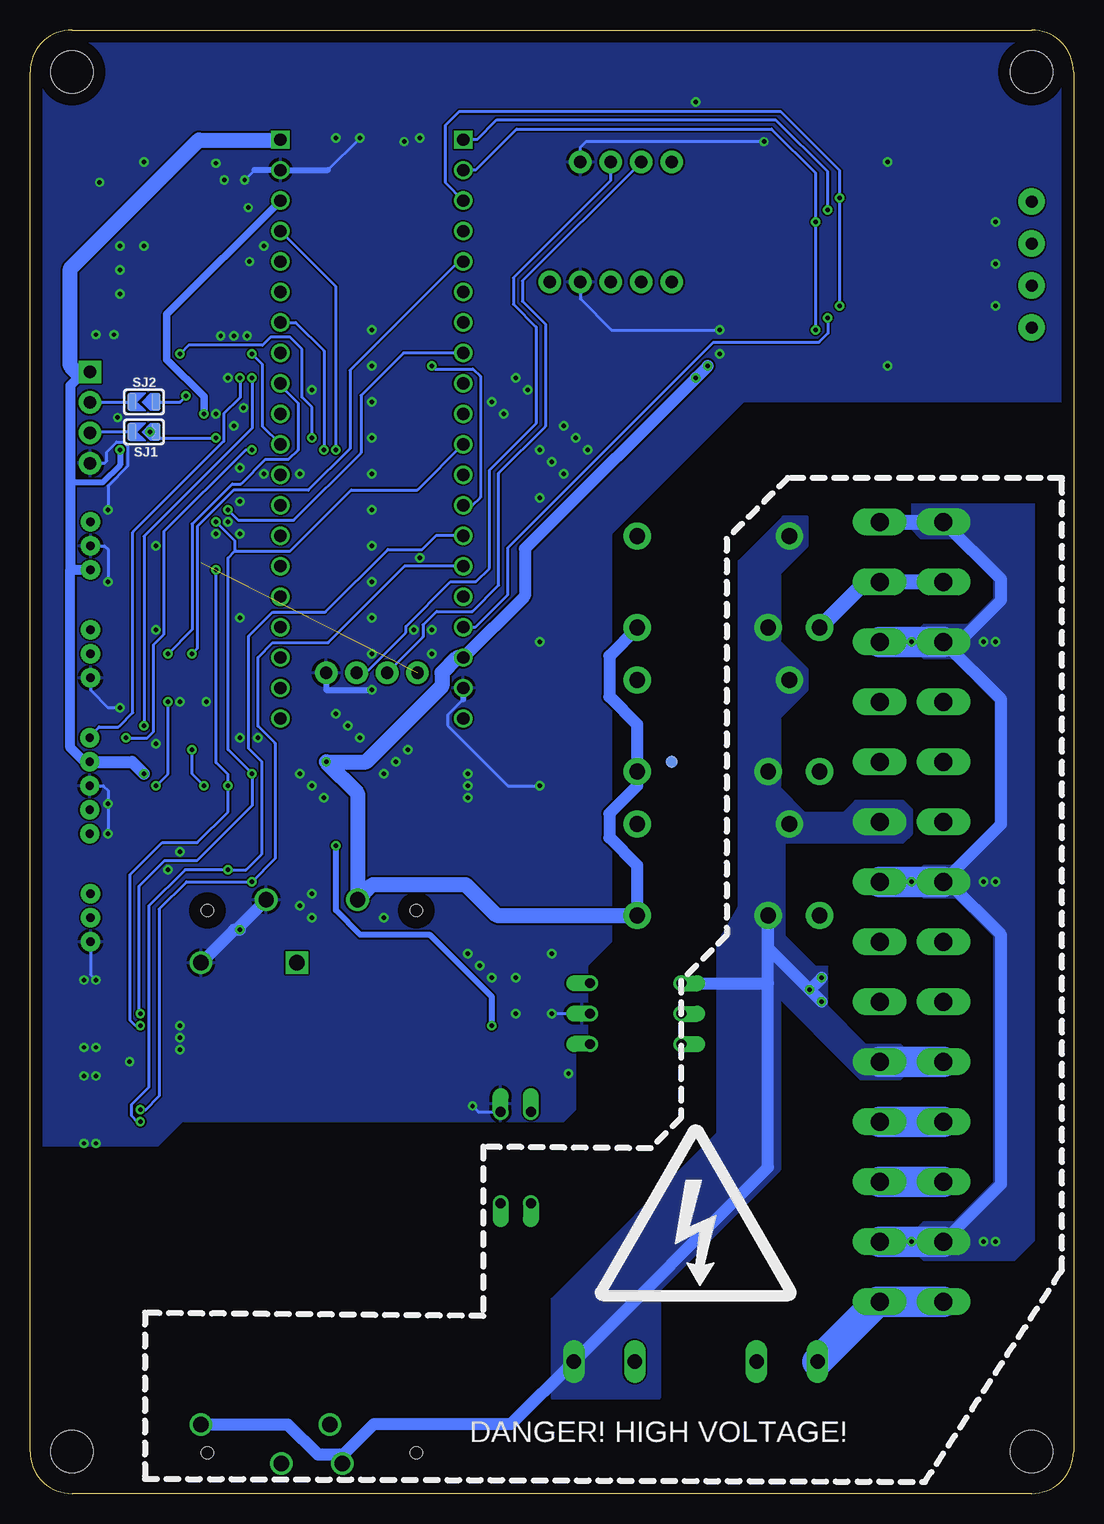
[diagram p3: board, bottom side, seen from below]

Size 87 x 122 mm. Coordinates in mm from the lower left corner, seen from the top.
Outline: 3.5,0 83.5,0 arc90 87,3.5 87,118.5 arc90 83.5,122 3.5,122 arc90 0,118.5 0,3.5 arc90 3.5,0
Copper layers (1*16): Top 0.035mm / dielectric 1.5mm / Bottom 0.035mm
Design rules "default": minimum track width 6mil, minimum drill 0.35mm, track to track 6mil, track to pad 6mil, pad to pad 6mil, via to via 6mil, smd to smd 6mil, copper to edge 40mil, drill to drill 6mil, minimum pad ring 10mil, minimum via ring 8mil, stop-mask expansion 4mil, vias tented up to drill 0mil, thermal gap 10mil
Holes 3.5 mm at 3.5,3.5 83.5,3.5 3.5,118.5 83.5,118.5

### Footprints (pad centres in the part's own frame; a part is rotated, then mirrored left to right if it is on the bottom)
SOIC-4 = smd 1.2 x 1.2: + 1.3,3.05; - -1.3,3.05; ~1 -1.3,-3.05; ~2 1.3,-3.05
C0603 = smd 1.1 x 1: 1 -0.85,0; 2 0.85,0
C1206 = smd 1.6 x 1.8: 1 -1.4,0; 2 1.4,0
DO214AC = smd 1.8 x 1.7: A 2.05,0; C -2.05,0
SMA = smd 2 x 2: A 2,0; C -2,0
SOD-123 = smd 1.2 x 0.7: A 1.85,0; C -1.85,0
FUSE1 = drill 1.194 long: 1A -10.16,0; 1B -5.08,0; 2A 10.16,0; 2B 5.08,0
0603 = smd 1.1 x 1: 1 -0.85,0; 2 0.85,0
SOT223 = smd 1.5 x 2: 1 -2.3,-3.15; 2 0,-3.15; 3 2.3,-3.15 | smd 3.8 x 2: 4 0,3.15
MOLEX-1X4 = drill 1.016 pad 1.88 square: 1 0,0 | drill 1.016 pad 1.88: 2 2.54,0; 3 5.08,0; 4 7.62,0
JST04_1MM_VERT = smd 0.6 x 1.55: 1 -1.478,0.775; 2 -0.478,0.775; 3 0.522,0.775; 4 1.522,0.775 | smd 1.2 x 2: NC1 -2.778,3.2; NC2 2.822,3.2
1X2-3.5MM = drill 1 pad 2.184: 1 1.8,0; 2 -1.7,0
JST-3-PTH-VERT = drill 0.7 pad 1.6: 1 -2,-0.55; 2 0,-0.55; 3 2,-0.55
JST-5-PTH-VERT = drill 0.7 pad 1.6: 1 -4,0.18; 2 -2,0.18; 3 0,0.18; 4 2,0.18; 5 4,0.18
62409-1 = drill 1.5 pad 1.9 long: A1 -2.65,0; A2 2.65,0
503398-1892_MOL = smd 0.711 x 1.092: 1 -2.38,5.776; 2 -1.28,5.776; 3 -0.18,5.776; 4 0.92,5.776; 5 2.02,5.776; 6 3.12,5.776; 7 4.22,5.776; 8 5.32,5.776 | smd 0.889 x 0.94: 9 -4.17,-6.689 | smd 1.041 x 0.787: 10 0.31,-6.764 | smd 1.143 x 1.829: 11 -6.26,5.761 | smd 0.864 x 2.794: 12 6.4,5.276 | smd 0.711 x 3.327: 13 -6.48,-5.489; 14 6.48,-5.489
1X04_NO_SILK = drill 1.016 pad 1.88: 1 0,0; 2 2.54,0; 3 5.08,0; 4 7.62,0
1X05_NO_SILK = drill 1.016 pad 1.88: 1 0,0; 2 2.54,0; 3 5.08,0; 4 7.62,0; 5 10.16,0
RELAY-JZC = drill 1.3 pad 2.286: 1 3.81,-8.89; 2 -3.81,2.032; 3 -3.81,6.35; 4 3.81,3.81; 5 -3.81,-8.89
CHIPLED_1206 = smd 1.5 x 1.5: A 0,-1.75; C 0,1.75
FIDUCIAL_1MM = smd 1 x 1: 1 0,0
DIL04 = drill 0.813 offset: 1 -1.27,-3.81; 2 1.27,-3.81; 3 1.27,3.81; 4 -1.27,3.81
DIL06O = drill 0.813 offset: 1 -2.54,-3.81; 2 0,-3.81; 3 2.54,-3.81; 4 2.54,3.81; 5 0,3.81; 6 -2.54,3.81
SM-PLG06 = drill 1.27: AC_L -23.5,2.54; AC_N -23.5,-2.54; VO+ 23.5,3.81; VO- 23.5,-3.81 | hole 1: -22.6,8.7; -22.6,-8.7; 22.6,8.7; 22.6,-8.7
IRM-10 = drill 1.27 square: +V 19.25,-1.25 | drill 1.27: -V 19.25,-9.25; AC/L -19.25,-9.25; AC/N -19.25,1.5
SOT23-3 = smd 0.8 x 0.9: 1 -0.95,-1; 2 0.95,-1; 3 0,1.1
SOT363 = smd 0.5 x 0.5: 1 -0.75,-0.9; 3 0.75,-0.9; 4 0.75,0.9; 6 -0.75,0.9 | smd 0.4 x 0.5: 2 0,-0.9; 5 0,0.9
SOT26 = smd 0.55 x 0.8: D1 -0.95,1.2; D2 0.95,1.2; G1 -0.95,-1.2; G2 0.95,-1.2; S1 0,1.2; S2 0,-1.2
SC70-6 = smd 0.3 x 0.66: 1 -0.65,-0.92; 2 0,-0.92; 3 0.65,-0.92; 4 0.65,0.92; 5 0,0.92; 6 -0.65,0.92
R0603 = smd 1 x 1.1: 1 -0.85,0; 2 0.85,0
R2512 = smd 1.8 x 3.2: 1 -2.8,0; 2 2.8,0
R1206 = smd 1.6 x 1.803: 1 -1.422,0; 2 1.422,0
SOLDERJUMPER_ARROW_NOPASTE = smd 0.762 x 1.524: 1 -1.016,0; 2 1.016,0
SMT-0540-S-R = smd 1 x 1: + 1.7,-2.7; - 1.7,2.7; M -1.7,-2.7
SOT223' = smd 1.219 x 2.235: 1 -2.311,-3.099; 2 0,-3.099; 3 2.311,-3.099 | smd 3.6 x 2.2: 4 0,3.099
BLACKPILL = drill 1.016 square: P1$1 -22.86,-7.62; P2$1 -22.86,7.62 | drill 1.016: P1$2 -20.32,-7.62; P1$3 -17.78,-7.62; P1$4 -15.24,-7.62; P1$5 -12.7,-7.62; P1$6 -10.16,-7.62; P1$7 -7.62,-7.62; P1$8 -5.08,-7.62; P1$9 -2.54,-7.62; P1$10 0,-7.62; P1$11 2.54,-7.62; P1$12 5.08,-7.62; P1$13 7.62,-7.62; P1$14 10.16,-7.62; P1$15 12.7,-7.62; P1$16 15.24,-7.62; P1$17 17.78,-7.62; P1$18 20.32,-7.62; P1$19 22.86,-7.62; P1$20 25.4,-7.62; P2$2 -20.32,7.62; P2$3 -17.78,7.62; P2$4 -15.24,7.62; P2$5 -12.7,7.62; P2$6 -10.16,7.62; P2$7 -7.62,7.62; P2$8 -5.08,7.62; P2$9 -2.54,7.62; P2$10 0,7.62; P2$11 2.54,7.62; P2$12 5.08,7.62; P2$13 7.62,7.62; P2$14 10.16,7.62; P2$15 12.7,7.62; P2$16 15.24,7.62; P2$17 17.78,7.62; P2$18 20.32,7.62; P2$19 22.86,7.62; P2$20 25.4,7.62
SO08 = smd 0.6 x 1.2: 1 -1.905,-2.8; 2 -0.635,-2.8; 3 0.635,-2.8; 4 1.905,-2.8; 5 1.905,2.8; 6 0.635,2.8; 7 -0.635,2.8; 8 -1.905,2.8
MSOP10 = smd 0.25 x 1: 1 -1,-2.113; 2 -0.5,-2.113; 3 0,-2.113; 4 0.5,-2.113; 5 1,-2.113; 6 1,2.113; 7 0.5,2.113; 8 0,2.113; 9 -0.5,2.113; 10 -1,2.113
VFSOP-8 = smd 0.25 x 0.65: P$1 -0.75,-1.45; P$2 -0.25,-1.45; P$3 0.25,-1.45; P$4 0.75,-1.45; P$5 0.75,1.45; P$6 0.25,1.45; P$7 -0.25,1.45; P$8 -0.75,1.45

### Placement (x,y rotation side)
B1  37.5,23 0 top
C1  63.5,111.5 90 top
C2  23.5,107.5 90 top
C3  9.9,107 270 top
C4  9.9,97.9 270 top
C5  27.5,34 90 top
C6  42.5,21.5 0 top
C7  54.5,64 0 top
C8  65,57 90 top
C9  75.5,85 0 top
C10  41.5,46 0 top
C11  70,112 0 top
C12  37.5,18 180 top
C13  48.5,37 270 top
C14  42.5,94 0 top
D1  58.5,106.5 0 top
D2  40.5,76 90 top
D3  40.5,64 90 top
D4  40.5,52 90 top
D5  46.5,15 270 top
D6  39.5,90 0 top
F1  31.5,11 0 top
FB1  9.8,104.2 0 top
FB2  9.8,109.8 0 top
FB3  9.8,95.1 0 top
FB4  9.8,100.7 0 top
IC1  55.5,56 270 top
IC2  28.5,106 0 top
J1  82,93.5 270 top
J2  78.8,32 270 top
J3  78.8,40 270 top
J4  3.5,106 270 top
J5  3.5,99 270 top
J6  81.4,79 90 top
J7  81.4,70 90 top
J8  82.2,59 90 top
J9  81.4,48 90 top
J10  13.5,81 0 top
J11  13.5,76 0 top
J12  13.5,71 0 top
J13  13.5,66 0 top
J14  13.5,61 0 top
J15  13.5,56 0 top
J16  13.5,51 0 top
J17  13.5,46 0 top
J18  13.5,41 0 top
J19  13.5,36 0 top
J20  13.5,31 0 top
J21  13.5,26 0 top
J22  13.5,21 0 top
J23  13.5,16 0 top
J24  75.5,103 270 top
J25  54.69,68.41 0 top
J26  33.5,111 0 top
J27  33.5,101 0 top
K1  27.5,76 90 top
K2  27.5,64 90 top
K3  27.5,52 90 top
LED1  43.5,76 0 top
LED2  43.5,64 0 top
LED3  43.5,52 0 top
LED4  23.5,103 180 top
MARK1  3.5,111 0 top
MARK2  3.5,11 0 top
MARK3  81.5,11 0 top
MARK4  81.5,111 0 top
MARK5  33.5,61 0 top
MARK6  33.5,61 0 bottom
OK1  46.5,28 0 top
OK2  36.5,40 90 top
PSU1  63.5,26 90 top
PSU2  63.5,25 90 top
Q1  43.5,81 90 top
Q2  43.5,69 90 top
Q3  43.5,57 90 top
Q4  46.5,77.5 180 top
Q5  46.5,65.5 180 top
Q6  46.5,53.5 180 top
Q7  75.5,90 90 top
Q8  60.5,103 0 top
Q9  56.5,103 0 top
Q10  46.5,20 0 top
Q11  74.5,57 180 top
Q12  74.5,64 270 top
R1  43.5,37 270 top
R2  31,34 270 top
R3  47.5,74 270 top
R4  47.5,62 270 top
R5  47.5,50 270 top
R6  46.5,81 270 top
R7  46.5,69 270 top
R8  46.5,57 270 top
R9  45.5,74 270 top
R10  45.5,62 270 top
R11  45.5,50 270 top
R12  23.5,98.5 90 top
R13  28.5,23 90 top
R14  46.5,37 90 top
R15  42.5,23.5 0 top
R16  75.5,93 180 top
R17  75.5,87 0 top
R18  72.5,92 270 top
R19  72.5,88 90 top
R20  41.5,18 180 top
R21  33.5,18 0 top
R22  33.5,25.5 270 top
R23  69,54 270 top
R24  67,54 270 top
R25  69,57 90 top
R26  67,57 90 top
R27  53.5,107 90 top
R28  53.5,103 90 top
R29  39.5,92 180 top
R30  39.5,94 0 top
R31  77.5,57 270 top
R32  71.5,57 270 top
R33  73.5,68 90 top
R34  75.5,68 90 top
SJ1  77.5,88.5 180 bottom
SJ2  77.5,91 180 bottom
SPK1  58.5,111 270 top
TR1  Z0107MNSOT-223  [SOT223']  24.5,42 90 top
U1  58.5,90 270 top
U2  15.5,107 270 top
U3  15.5,98 270 top
U4  76.5,79 180 top
U5  73,79 180 top
U$1  [HV_LOGO_3]  40.33,16.08 0 bottom

### Tracks (layer width: path | path; a pad name or v marks a point on that pad's centre or on a via)
3V3  (via drill 0.35)  (1 unrouted)
  Top 0.254: C9.1 74.65,83.22 72.75,81.32 U5.P$3 U5.P$6 | R27.2 54.95,109.3 SPK1.+ | R14.2 47.65,39 v48.5,39 | LED4.A C2.1 | D6.C 38.65,91 R29.2 38.02,92 33.5,96.52 J27.1
  Top 0.406: Q7.2 Q7.5 v72.5,90
  Top 0.508: R18.2 v72.5,90 R19.2 72.68,88.85 73.58,87.94 73.58,85.81 74.4,85 C9.1 | v61.5,54 61.5,54.8 60.43,55.87 58.78,55.87 IC1.4 | C13.1 v48.5,39 | J25.1 53.65,67.37 C7.1 | U3.4 14.17,96.09 14.68,96.6 14.68,104.22 13.8,105.09 U2.4 13.9,105.09 14.68,105.87 14.68,108.03 16.77,110.12 19.39,110.12 22.86,106.65 C2.1 | SPK1.+ 57.15,110.65 58.79,110.65
  Top 0.61: J24.4 82.29,102.08 82.53,102.32 82.53,106.05 82.14,106.45 80.28,106.45 79.71,105.88 68.03,105.88 U1.P2$3 | D1.C 56.45,108.65 SPK1.+ | J2.2 78.54,32.48 76.02,35 | J3.2 78.54,40.48 76.02,43
  Top 0.813: C7.1 53.56,64.09 51.39,64.09 U1.P1$20 | R23.1 69.76,54.85 76.02,48.59 76.02,43 76.02,35
  Top 1.016: IC1.4 58.65,56.02 58.78,56.15 C8.1 R26.1 | R26.1 R25.1 R23.1 R24.1 R26.1 | C2.1 26,106.65 IC2.4 30.35,111 J26.1 | J26.1 J27.1 | C1.1 63.44,110.59 | U1.P2$3 65.48,107.78 63.5,109.76 C1.1 | J26.1 37.39,114.89 56.33,114.89 57.73,113.49 57.73,111.71 58.79,110.65 C1.1
  Top 1.27: U1.P1$20 58.65,56.83 IC1.4
  Bottom 0.508: v48.5,39 48.5,41.41 53.69,46.6 59.47,46.6 61.5,48.63 v61.5,54
  Bottom 0.61: v72.5,90 72.5,91.44 75.59,94.53 75.59,98.31 U1.P2$3
3WAY
  Bottom 1.016: J11.A2 17.34,76
  Bottom 1.27: J11.A1 J11.A2 | 17.34,76 K1.3
5V  (via drill 0.35)
  Top 0.254: R16.2 75.71,94.06 81.44,94.06 J1.1 | U4.8 76.5,77.78 76.91,78.18 78.03,78.18 | 78.03,78.18 80.77,78.18 J6.1 | 78.03,78.18 78.03,75.81 77.05,74.83 74.83,74.83 73.25,76.41 U5.P$7 | R17.2 v79.5,87 | R32.2 72.32,56.97 74.5,56.97 76.68,56.97 R31.2
  Top 0.406: Q11.S1 74.5,56.97 Q11.S2 74.5,60.39 74.62,60.51
  Top 0.61: 38.69,48.19 D4.C 42.11,48.39 44.74,48.39 R11.2 R5.2 | K2.5 38.69,60.19 D3.C 41.98,60.52 44.87,60.52 R10.2 R4.2 | K1.5 38.69,72.19 D2.C 41.98,72.52 44.61,72.52 45.25,73.15 R9.2 R3.2
  Top 1.016: C11.1 68.19,112.86 U1.P2$1 | C10.1 38.46,48.19 K3.5 | IC2.3 30.8,93.7 v31.5,93 | v62.3,61 62.85,61.55 69.67,61.55 70.7,60.51 74.62,60.51 76.99,60.51 v77.5,60
  Top 1.27: K3.5 38.69,48.19 | IC1.3 52.78,53.72 55.71,50.79 58.4,50.79 PSU1.VO+ 64.75,44.44 PSU2.+V
  Bottom 0.508: v79.5,87 79.5,85.75 80.97,84.28 83.64,84.28
  Bottom 0.813: J8.4 82.46,61 83.64,62.18 83.64,77.04 | J6.1 83.6,77 83.64,77.04 | J1.1 82.51,93.5 83.64,92.37 83.64,84.28 83.64,77.04
  Bottom 1.016: K1.5 36.39,72.14 38.7,69.83 38.7,66.43 36.39,64.12 K2.5 36.39,58.99 38.7,56.68 38.7,54.68 36.39,52.37 K3.5 | J8.4 78.5,61 v77.5,60 | U1.P1$18 45.74,74.82 45.74,78.76 v30.5,94 v31.5,93
  Bottom 1.27: U1.P2$1 66.16,112.83 72.93,112.83 83.64,102.12 83.64,93.99 83.14,93.5 J1.1 | K3.5 48.09,48.19 50.67,50.77 58.42,50.77 PSU1.VO+ 59.69,58.39 v62.3,61 58.97,61 52.66,67.31 52.66,68.41 51.39,69.68 U1.P1$18
AC_N  (via drill 0.35)
  Top 1.016: PSU1.AC_N 66.04,2.88 62.92,6 62.25,6 PSU2.AC/N 62.57,6.32 61.39,7.51 47.12,7.51 44.64,5.03 34.61,5.03 32.08,7.57 R21.1 | R21.1 29.88,20.2 R13.1 26.69,20.2 20.89,26 J21.A2 | J22.A2 21.44,21 24.44,18 R21.1
  Top 1.27: v6.5,71 v7.5,71 | v6.5,51 v7.5,51 | v13.5,21 v7.5,21 v6.5,21
  Bottom 1.016: J22.A1 6.04,25.81 6.04,46.56 10.48,51 J16.A1 6.04,55.81 6.04,66.19 J12.A1 9.54,71 6.04,74.5 6.04,76.19 J10.A1
  Bottom 1.27: J10.A2 J10.A1
  Bottom 2.54: J22.A1 v13.5,21 J22.A2 | J16.A2 v13.5,51 J16.A1 | J12.A2 v13.5,71 J12.A1 | J21.A1 J21.A2
  pour Bottom (no thermals): 13.53,82.5 3.23,82.5 3.23,21.05 4.9,19.38 12.52,19.38 13.66,20.52 13.66,21.54 12.52,22.68 9.98,22.68 6.67,25.99 6.67,46.43 9.85,49.61 12.52,49.61 13.41,50.5 13.41,51.51 12.52,52.4 10.1,52.4 6.55,55.96 6.55,65.99 10.1,69.55 12.52,69.55 13.66,70.69 13.66,71.33 12.52,72.47 8.83,72.47 6.67,74.63 6.67,76.15 10.1,79.58 12.77,79.58 13.53,80.34
  pour Top (no thermals): 13.53,82.5 1.53,82.5 1.53,22.75 4.9,19.38 12.52,19.38 13.66,20.52 13.66,21.54 12.52,22.68 9.98,22.68 6.67,25.99 6.67,46.43 9.85,49.61 12.52,49.61 13.41,50.5 13.41,51.51 12.52,52.4 10.1,52.4 6.55,55.96 6.55,65.99 10.1,69.55 12.52,69.55 13.66,70.69 13.66,71.33 12.52,72.47 8.83,72.47 6.67,74.63 6.67,76.15 10.1,79.58 12.77,79.58 13.53,80.34
AC_P  (via drill 0.35)
  Top 1.016: J19.A2 16.91,36 21.4,40.49 TR1.4 TR1.2 | F1.2A 42.92,12.26 R20.1
  Top 1.778: K1.4 25.47,78.03 K1.2 25.47,69.59 K2.4 25.47,66.03 K2.2 25.47,57.59 K3.4 25.47,54.03 K3.2 | J15.A2 16.34,55.81
  Top 2.54: K3.4 16.34,55.81 | J15.A1 J15.A2
  Bottom 1.016: 25.47,42.54 25.47,27.19 F1.2A 46.87,5.79 58.3,5.79 60.96,3.13 PSU1.AC_L 60.96,3.26 62.99,3.26 65.48,5.75 PSU2.AC/L | 25.47,42.54 K3.2 25.47,45.47 v22,42 | v21,43 v22,42 | v21,41 v22,42 | OK2.4 25.47,42.54
  Bottom 2.54: J19.A1 J19.A2
  pour Bottom (no thermals): 22.2,81.4 24.2,81.4 27.9,77.7 27.9,48.88 29.68,45.78 29.68,30.02 43.5,16.2 43.5,8 34.5,8 34.5,17 24.5,27 24.5,46 24.1,46.4 24.1,54.3 14.2,54.3 13.5,55 13.5,57 14.2,57.7 18.2,57.7 19.2,56.7 22.4,56.7 24.5,58.8 24.5,64.7 22.2,67 22.2,68.7 24.5,71 24.5,76.7 22.2,79
  pour Bottom (no thermals): 13.5,35.4 14.4,34.5 17.8,34.5 25.5,42.2 25.5,46 24.5,47 21.5,44 20.5,44 20.5,40.7 17.3,37.5 14.4,37.5 13.5,36.6
GND  (via drill 0.35)
  Top 0.254: v82.5,42.8 v82.5,37.2 | v82.5,34.8 v82.5,29.2 | v81.5,96.6 81.75,96.6 82.39,97.23 82.39,99.66 82.17,99.88 J24.6 | U4.7 76,78.5 v76.5,79 | U4.6 75.5,78 v76.5,79 | U4.3 76.5,79.07 | 76.5,79.07 v76.5,79 | U4.1 77.5,80 v76.5,79 | 76.5,79.07 75.5,80.07 U4.5 75.5,81.88 75.25,82.12 74.24,82.12 73.25,81.13 U5.P$2 | v76.5,79 J6.2 | R30.1 38.65,94.64 41.12,97.11 J27.4
  Top 0.508: v69.1,109.5 69.1,107.5 v68.8,107.2 | v81.2,109.3 79.5,111 v77.5,111 | v67.5,104 68.29,104 68.7,103.59 v68.7,102.7 | v71.1,96.5 72.12,96.5 79.5,103.88 v79.5,104
  Top 0.813: Q1.2 v44.5,83 | Q2.2 v44.5,71 | Q3.2 v44.5,59
  Bottom 0.254: OK2.2 v43.5,40 | 62.18,110.32 v59.5,113 | 68.28,110.32 v69.1,109.5 | 50.88,66.2 52.17,64.9 52.17,64.04 47.13,59 v44.5,59 | v50.1,32.3 49.61,31.81 OK1.3 | J9.1 81.95,43.25 v81.5,42.8 | J8.3 80.88,59 80.5,58.62 v80.5,57.5 v80.5,55 | J7.1 81.95,66.98 80.47,65.5 v79.5,65.5 | J6.2 80.81,79 80.5,78.69 v80.5,76 | v80.5,82 80.5,84 78.84,85.65 78.84,87.27 79.23,87.66 79.77,87.66 80.6,86.83 80.6,86.07 80.79,85.88 J1.4 | J26.4 41.12,112.22 40.61,112.73 25.83,112.73 v25.8,112.7 | J27.4 41.12,99.6 38.52,97 v29.5,97
  Bottom 0.508: 62.18,110.32 U1.P2$2 68.28,110.32 | U1.P1$19 50.88,66.2 | J25.4 62.31,67 v58.5,67 | 69.5,47.31 v69.5,47
  Bottom 1.016: PSU1.VO- 69.5,47.31 | v69.5,47 70,47 PSU2.-V
  other vias: 6.5,102.5 68.9,96.5 70,96.5 80,96.6 70.8,109.5 81.5,37.2 81.5,34.8 81.5,29.2 57.5,48 72.3,66 48.5,43 49.5,44 50.5,45 50.5,58 50.5,59 50.5,60 55.5,62 56.5,61 57.5,60 62.5,58 63.5,59 64.5,60 59.5,63 60.5,64 61.5,65 58.5,70 58.5,73 58.5,76 58.5,79 58.5,82 58.5,85 58.5,88 78.7,36 63.5,92 53.5,72 55,72 53.5,70 40.5,87 41.5,88 42.5,89 42.5,85 43.5,86 44.5,87 61.5,113 55.8,112.7 54.5,113 71.5,110.9 79.5,100 71.5,90 58.5,97 58.5,94 58.5,91 31.5,116 15.5,111 15.5,94 6.5,106 6.5,99 74.5,37 74.5,38 74.5,39 42.1,35 79.7,89.7 69.5,85.5 64.5,85 70,89 43.5,45 46.5,43 46.5,40 75.5,52 46.5,93 45.5,92 48.5,91 47.5,90 54.5,78 76.5,62.5 63.5,50 64.5,49 63.5,48 69.5,63 69.5,73 74.5,66 71.5,80 68,63 70.5,93 77.5,104 79.5,102 29.5,95 67.5,85 69.5,82.7 74.5,53.5 76.5,72 70.5,81 69.5,80 69.2,90.5
  pour Bottom: 0.5,91 27.5,91 38.5,80 38.5,46 40.5,44 40.5,38 41.5,37 41.5,32 42.5,31 74.25,31 76.3,28.95 87.5,28.95 87.5,119 83.5,123 3.5,123 -0.5,119 -0.5,92
  pour Top: 0.5,91 27.5,91 38.5,80 38.5,46 40.5,44 40.5,38 41.5,37 41.5,32 42.5,31 74.2,31 76.2,29 87.5,29 87.5,119 83.5,123 3.5,123 -0.5,119 -0.5,92
HEATER_1
  Top 1.778: J14.A2 20.34,61 K2.3
  Top 2.54: J14.A1 J14.A2 J13.A2 J13.A1
HEATER_2
  Top 1.778: J17.A2 18.96,46 K3.3
  Top 2.54: J17.A1 J17.A2 J18.A2 J18.A1
I2C1_SCL  (via drill 0.35)
  Top 0.254: v70.5,52 70.4,52 69.25,53.15 R23.2 | J2.4 78.32,30.48 v77.8,31
  Bottom 0.254: U1.P1$14 53.17,79.84 54.31,78.7 57.15,78.7 62.39,73.47 66.77,73.47 68.77,71.46 68.77,62.1 67.71,61.03 67.71,53.28 68.98,52 v70.5,52 74.07,52 77.1,48.97 77.1,33.86 78.56,32.4 78.56,31.51 78.05,31 v77.8,31
I2C1_SDA  (via drill 0.35)
  Top 0.254: v68.5,51 68.5,51.9 67.25,53.15 R24.2 | J2.3 78.32,31.48 v77.8,32
  Bottom 0.254: U1.P1$15 55.76,77.3 62.13,70.92 66.77,70.92 67.98,69.71 67.98,63.96 66.58,62.56 66.58,52.92 v68.5,51 73.94,51 76.23,48.71 76.23,33.13 77.36,32 v77.8,32
I2C2_SCL  (via drill 0.35)
  Top 0.254: v61.5,87 61.5,86.46 64.38,83.58 66.94,83.58 71.5,79.02 v71.5,77 72.05,77.55 U5.P$5 | J3.4 78.32,38.48 v77.8,39 | v70.5,59 70.48,59 69.33,57.85 R25.2
  Bottom 0.254: v61.5,87 61.52,87.02 61.52,100.64 U1.P2$4 | v77.8,39 78.19,39 78.67,39.46 78.67,51.58 75.98,54.27 73.06,54.27 70.5,56.83 v70.5,59 70.5,59.92 71.5,60.92 v71.5,77
I2C2_SDA  (via drill 0.35)
  Top 0.254: R26.2 67.33,57.85 68.5,59.02 v68.5,60 | U5.P$4 72.05,80.45 v71.5,81 | J3.3 78.32,39.48 v77.8,40
  Bottom 0.254: U1.P1$11 54.69,83.65 60.21,83.65 65.32,78.55 69.95,78.55 | v77.8,40 77.93,40 77.93,50.62 75.78,52.76 73.08,52.76 68.5,57.34 v68.5,60 68.5,60.02 70.5,62.02 70.5,78 69.95,78.55 | v71.5,81 69.95,79.45 69.95,78.55
N$1
  Bottom 1.016: 16.34,16 J23.A2
  Bottom 2.54: F1.1A 16.34,16 | J23.A2 J23.A1
  pour Top (no thermals): 13.5,17 13.9,17.4 13.9,17.5 17.6,17.5 19,17.5 23.5,13 26.5,13 27.5,12 27.5,10 26.5,9 20.5,9 19.5,9 13.5,15
N$2
  Top 0.406: D5.C 45.55,18 Q10.1 45.52,19 44.12,20.4 40.81,20.4 37.77,23.45 32.77,23.45 32.47,23.75 32.47,25.68 33.14,26.35 R22.1 33.8,26.05 B1.-
N$3
  Top 0.254: J4.2 6.85,107.7 FB2.1
N$4
  Top 0.254: J4.1 FB1.1
N$5
  Top 0.254: FB2.2 10.65,108.6 C3.1 10.12,107.64 U2.2
N$6
  Top 0.254: J5.2 FB4.1
N$7
  Top 0.406: Q10.3 47.77,22.37 OK1.2
N$8
  Top 0.508: OK2.6 31,35.77 R2.1
N$9
  Top 0.508: TR1.3 28.74,44.31 29.7,43.35 29.7,33.68 30.24,33.15 R2.2
N$10
  Top 0.406: D2.A 43.42,78 LED1.C
  Top 0.61: K1.1 38.69,79.81 D2.A 40.5,79.1 Q1.3
N$11
  Top 0.406: D3.A 43.42,66 LED2.C
  Top 0.61: K2.1 38.69,67.81 D3.A 40.5,67.1 Q2.3
N$12
  Top 0.406: LED3.C 43.18,54.18 40.5,54.18
  Top 0.61: K3.1 38.69,55.81 D4.A 40.5,54.18 40.5,55.1 Q3.3
N$13
  Top 0.61: Q1.1 44.5,79.55 Q4.2
N$14
  Top 0.61: Q2.1 44.5,67.55 Q5.2
N$15
  Top 0.61: Q3.1 44.5,55.55 Q6.2
N$16
  Top 0.406: R8.2 47.45,55.2 Q6.1
N$17
  Top 0.61: R5.1 46.5,51.85 Q6.3
N$18
  Top 0.61: R4.1 47.5,63.36 46.5,64.36 Q5.3
N$19
  Top 0.406: R7.2 47.45,67.2 Q5.1
N$20
  Top 0.61: R3.1 47.5,75.36 46.5,76.36 Q4.3
N$21
  Top 0.406: R6.2 47.45,79.2 Q4.1
N$22
  Top 0.254: U5.P$8 73.75,76.7 75.09,75.36 76.88,75.36 77.5,75.98 U4.10
N$23
  Top 0.254: J5.1 6.85,97.2 FB3.1
N$24
  Top 0.406: R9.1 44.1,74.85 LED1.A
N$25
  Top 0.254: U3.2 10.02,98.64 C4.1 10.65,99.5 FB4.2
N$26
  Top 0.254: FB1.2 10.65,105.4 C3.2 10.12,106.36 U2.3
N$27
  Top 0.254: LED4.C R12.2
N$28
  Top 0.406: R10.1 44.1,62.85 LED2.A
N$29
  Top 0.406: LED3.A 44.1,50.85 R11.1
N$30
  Top 0.61: SPK1.- 60.55,108.65 D1.A 60.5,106.95 Q8.3
N$31
  Top 0.254: FB3.2 10.65,96.3 C4.2 10.21,97.36 U3.3
N$32
  Top 1.016: C5.1 27.5,25.8 R13.2
N$33
  Top 0.254: Q8.1 Q9.2
N$34
  Top 0.254: R28.2 54.34,103.85 55.55,102.64 Q9.1
N$35
  Top 0.254: R27.1 53.55,106.15 55.61,104.08 56.48,104.08 Q9.3
N$36
  Top 0.406: R21.2 C12.2 36.2,18.45 B1.~1
N$37
  Top 0.406: R20.2 C12.1 38.8,18.45 B1.~2
N$38
  Top 0.254: U5.P$1 73.75,78.67 74.24,78.18 74.24,77.04 75.38,75.9 76.66,75.9 77,76.24 U4.9
N$39
  Top 0.254: OK2.1 41.84,37.46 43.15,36.15 R1.2
N$41
  Top 0.406: Q11.D2 73.55,55.25 74.07,54.73 74.84,54.73 81.57,48 J9.2
N$42
  Top 0.406: Q11.D1 75.45,55.29 80.74,50 J9.3
N$43
  Top 0.406: D5.A 46.5,14.22 48.46,16.18 48.46,17.99 Q10.2 46.41,20.04 45.57,20.04 44.11,21.5 C6.2
N$44
  Top 0.406: R15.2 44.04,24.19 OK1.1
N$45
  Top 0.406: C6.1 R15.1 39.1,26.05 B1.+ 37.4,24.65 R22.2
N$46
  Top 0.254: Q12.2 73.06,64 72.59,64.47 72.59,65.1 73.5,66.02 R33.1
N$47  (via drill 0.35)
  Top 0.254: R32.1 71.85,58.2 Q11.G2 72.75,59 v72.5,59 | v73.5,62 73.5,63.27 Q12.3
  Bottom 0.254: v72.5,59 73.5,60 v73.5,62
N$48  (via drill 0.35)
  Top 0.254: R31.1 77.15,58.2 Q11.G1 76.25,59 v76.5,59 | Q12.6 75.42,65.92 v75.5,66
  Bottom 0.254: v76.5,59 75.5,60 v75.5,66
N$49
  Top 0.254: Q12.5 76.06,64 76.4,64.34 76.4,66.25 R34.1
NRST
  Top 0.254: U1.P2$16 66.12,75.31 57.8,83.62 49.81,83.62 43.44,90 D6.A 40.35,91 R29.1 41.98,92 43.35,93.36 C14.2
PA0
  Top 0.254: U1.P2$15 67.41,76 67.41,66.45 66.75,65.79 65.48,65.79 64.71,66.55 64.71,67.9 61.67,70.94 49.85,70.94 49.33,70.42 49.33,48.33 45.53,44.53 45.53,38.88 45.23,38.58 45.23,36.15 | OK1.4 45.23,36.15 | R14.1 45.23,36.15
PA1
  Top 0.254: U1.P2$14 72.71,73.25 78.7,73.25 J7.2
PA2
  Top 0.254: U1.P2$13 67.9,80.6 67.9,78.82 72.92,73.8 79.14,73.8 80.93,72 J7.3
PA6  (via drill 0.35)
  Top 0.254: R34.2 v75.5,70
  Bottom 0.254: U1.P2$9 66.12,92.36 64.66,90.9 64.66,86.99 65.46,86.19 67.38,86.19 69.41,84.16 70.14,84.16 73.48,80.82 73.48,72.02 v75.5,70
PA8  (via drill 0.35)
  Top 0.254: R33.2 v73.5,70
  Bottom 0.254: U1.P1$5 51.26,102.7 60.32,93.64 60.32,87.12 63.81,83.63 70.03,83.63 73.06,80.61 73.06,70.44 v73.5,70
PB0  (via drill 0.35)
  Top 0.254: v62.5,87 63.28,86.22 67.72,86.22 v68.5,87 | v79,63 80.31,61.69 80.31,58.71 J8.2
  Bottom 0.254: U1.P2$7 64.85,97.62 62.49,95.26 v62.49,87.01 v62.5,87 | v68.5,87 69.02,87 75.84,80.18 75.84,71.62 76.73,70.73 76.73,63.5 77.23,63 v79,63
PB1  (via drill 0.35)
  Top 0.254: U1.P2$6 64.46,98.5 64.46,94.5 65.18,93.78 66.95,93.78 67.74,93 v68.5,93 | v77.5,64 77.5,62.82 79.26,61.05 79.26,57.76 J8.1
  Bottom 0.254: v68.5,93 68.5,88.8 77.5,79.8 v77.5,64
PB2  (via drill 0.35)
  Top 0.254: U1.P2$5 63.19,99.77 63.19,93.55 65.48,91.26 67.76,91.26 v69.5,93
  Bottom 0.254: v69.5,93 69.5,91.35 70.84,90.01 70.84,87.73 78.43,80.14 78.43,65.1 79.62,63.91 81.23,63.91 82.02,63.13 J8.5
PB5  (via drill 0.35)
  Top 0.254: R28.1 v53.5,94
  Bottom 0.254: v53.5,94 53.25,93.75 50.07,93.75 49.46,93.13 49.46,83.04 50.12,82.38 U1.P1$13
PB8
  Top 0.254: R1.1 44.9,39.25 44.9,44.73 48.83,48.67 48.83,70.6 49.5,71.26 49.5,73.38 U1.P1$16
PC13
  Top 0.254: U1.P2$19 66.12,67.52 61.67,71.97 56.85,71.97 52.78,76.03 50.12,76.03 48.91,74.83 48.91,71.31 48.41,70.8 48.41,59.76 R8.1
PC14
  Top 0.254: R7.1 48.41,71.75 48.41,76.81 50.2,78.59 51.49,78.59 55.45,74.63 61.17,74.63 U1.P2$18
PC15
  Top 0.254: R6.1 46.76,81.85 47.53,81.08 54.72,81.08 58.38,77.43 60.91,77.43 U1.P2$17
PRESSURE
  Top 0.254: U4.4 76,81.98 76.27,82.25 77.64,82.25 78.89,81 J6.3
PUMP_P
  Top 1.016: TR1.1 27.5,39.59 C5.2 25.88,35.4 21.48,31 J20.A2
  Bottom 2.54: J20.A1 J20.A2
RTS
  Top 0.254: R30.2 C14.1 41.65,94.64 43.66,96.64 J27.5
SPI1_MISO  (via drill 0.35)
  Top 0.254: J24.7 81.23,98.82 78.36,98.82 74.54,95 v74.5,95 | U1.P1$12 52.02,86.06 58.88,86.06 60.82,88 v63.5,88
  Bottom 0.254: v63.5,88 63.5,90.56 64.32,91.38 64.32,95.38 65.31,96.38 66.95,96.38 67.61,95.72 73.78,95.72 v74.5,95
SPI1_MOSI
  Top 0.254: U1.P2$8 67.01,95.08 67.9,94.19 70.69,94.19 79.68,103.18 J24.3
SPI1_NSS  (via drill 0.35)
  Top 0.254: J24.2 80.26,104.28 79.83,104.7 79.23,104.7 72.45,97.92 68.75,97.92 67.99,97.16 67.99,95.51 v68.5,95
  Bottom 0.254: U1.P2$11 67.61,88.95 67.61,94.11 v68.5,95
SPI1_SCK
  Top 0.254: U1.P2$10 67.64,90 68.91,91.27 69.8,91.27 71.19,92.66 71.19,93.42 78.75,100.98 J24.5
SPI2_MISO  (via drill 0.35)
  Top 0.254: U2.7 19.13,107.64 v19.5,108 | U3.7 19.13,98.64 v19.5,99
  Bottom 0.254: v19.5,99 v19.5,108 19.5,110.29 24.39,115.17 51.25,115.17 52.4,114.03 52.4,109.3 U1.P1$3
SPI2_NSS  (via drill 0.35)
  Top 0.254: U2.6 19.86,106.36 v20.5,107
  Bottom 0.254: v20.5,107 20.5,110.17 24.84,114.51 48.09,114.51 49.74,112.86 U1.P1$1
SPI2_NSS2  (via drill 0.35)
  Top 0.254: U3.6 19.86,97.36 v20.5,98
  Bottom 0.254: v20.5,98 20.46,97.96 20.46,96.73 21.23,95.96 30.03,95.96 47.18,78.81 47.18,74.9 49.86,72.22 U1.P1$17
SPI2_SCK  (via drill 0.35)
  Top 0.254: U3.5 20.59,96.09 v21.5,97 | U2.5 20.59,105.09 v21.5,106
  Bottom 0.254: v21.5,97 v21.5,106 21.5,110.06 25.18,113.75 46.44,113.75 49.86,110.32 U1.P1$2
SWCLK
  Bottom 0.254: J25.3 59.03,68.41 55.66,71.78 55.66,72.27 51.92,76 49.81,76 48.7,77.12 48.7,85.3 44.8,89.19 44.8,97.23 46.71,99.14 46.71,101.35 38.58,109.48 J26.3
SWDIO
  Bottom 0.254: J25.2 54.24,71.4 54.24,72.4 53.1,73.54 50.12,73.54 47.93,75.73 47.93,85.05 44.04,88.94 44.04,97.49 45.95,99.39 45.95,101.09 J26.2
UART1_RX
  Top 0.254: J27.3 38.58,101.07 40.36,102.85 45.65,102.85 U1.P1$7
UART1_TX
  Top 0.254: J27.2 36.04,101.2 38.73,103.9 47.14,103.9 U1.P1$6
UART6_5V_RX
  Top 0.254: R16.1 76.35,90.8 Q7.3 81.79,90.75 J1.2
  Bottom 0.254: J1.2 81.96,91 SJ2.2
UART6_5V_TX
  Top 0.254: R17.1 74.65,89.2 Q7.6 74.98,89.25 76.39,87.84 77.61,87.84 78.19,88.42 J1.3
  Bottom 0.254: SJ1.2 78.56,88.54 81.88,88.54 J1.3
UART6_RX  (via drill 0.35)
  Top 0.254: Q7.4 74.6,90.9 v74,91.5 72.65,92.85 R18.1 68.36,88.7 65.44,88.7 61.6,92.54 U1.P1$9
  Bottom 0.254: SJ2.1 74.5,91 v74,91.5
UART6_TX  (via drill 0.35)
  Top 0.254: Q7.1 77,88.65 v77,88.5 | R19.1 72.35,87.15 v71.5,88 70.5,87 v70.5,82
  Bottom 0.254: SJ1.1 v77,88.5 76.5,88 v71.5,88 | v70.5,82 69.63,81.13 65.01,81.13 59.4,86.73 59.4,91.53 55.86,95.08 U1.P1$8

### Text on the board
Top: iuiuiu v1
tPlace: 3V3 / SWDIO / SWCLK / GND | – / + / / / / – / + | 3V3 / TX / RX / GND / DTR | + / R / T / - | S / GND / 5V | 3WAY | S / B / GND | H1 / / / / SSR1 | D2 / 5V / GND / CLK / D1 | SSR2 / SSR1 / GND | H2 / / / / SSR2 | I2C | I2C | + / PUMP / - | N / AC / L | DANGER! HIGH VOLTAGE!
bPlace: DANGER! HIGH VOLTAGE!